# Altium project ethercat32.PrjPcb (part 1 of 3)
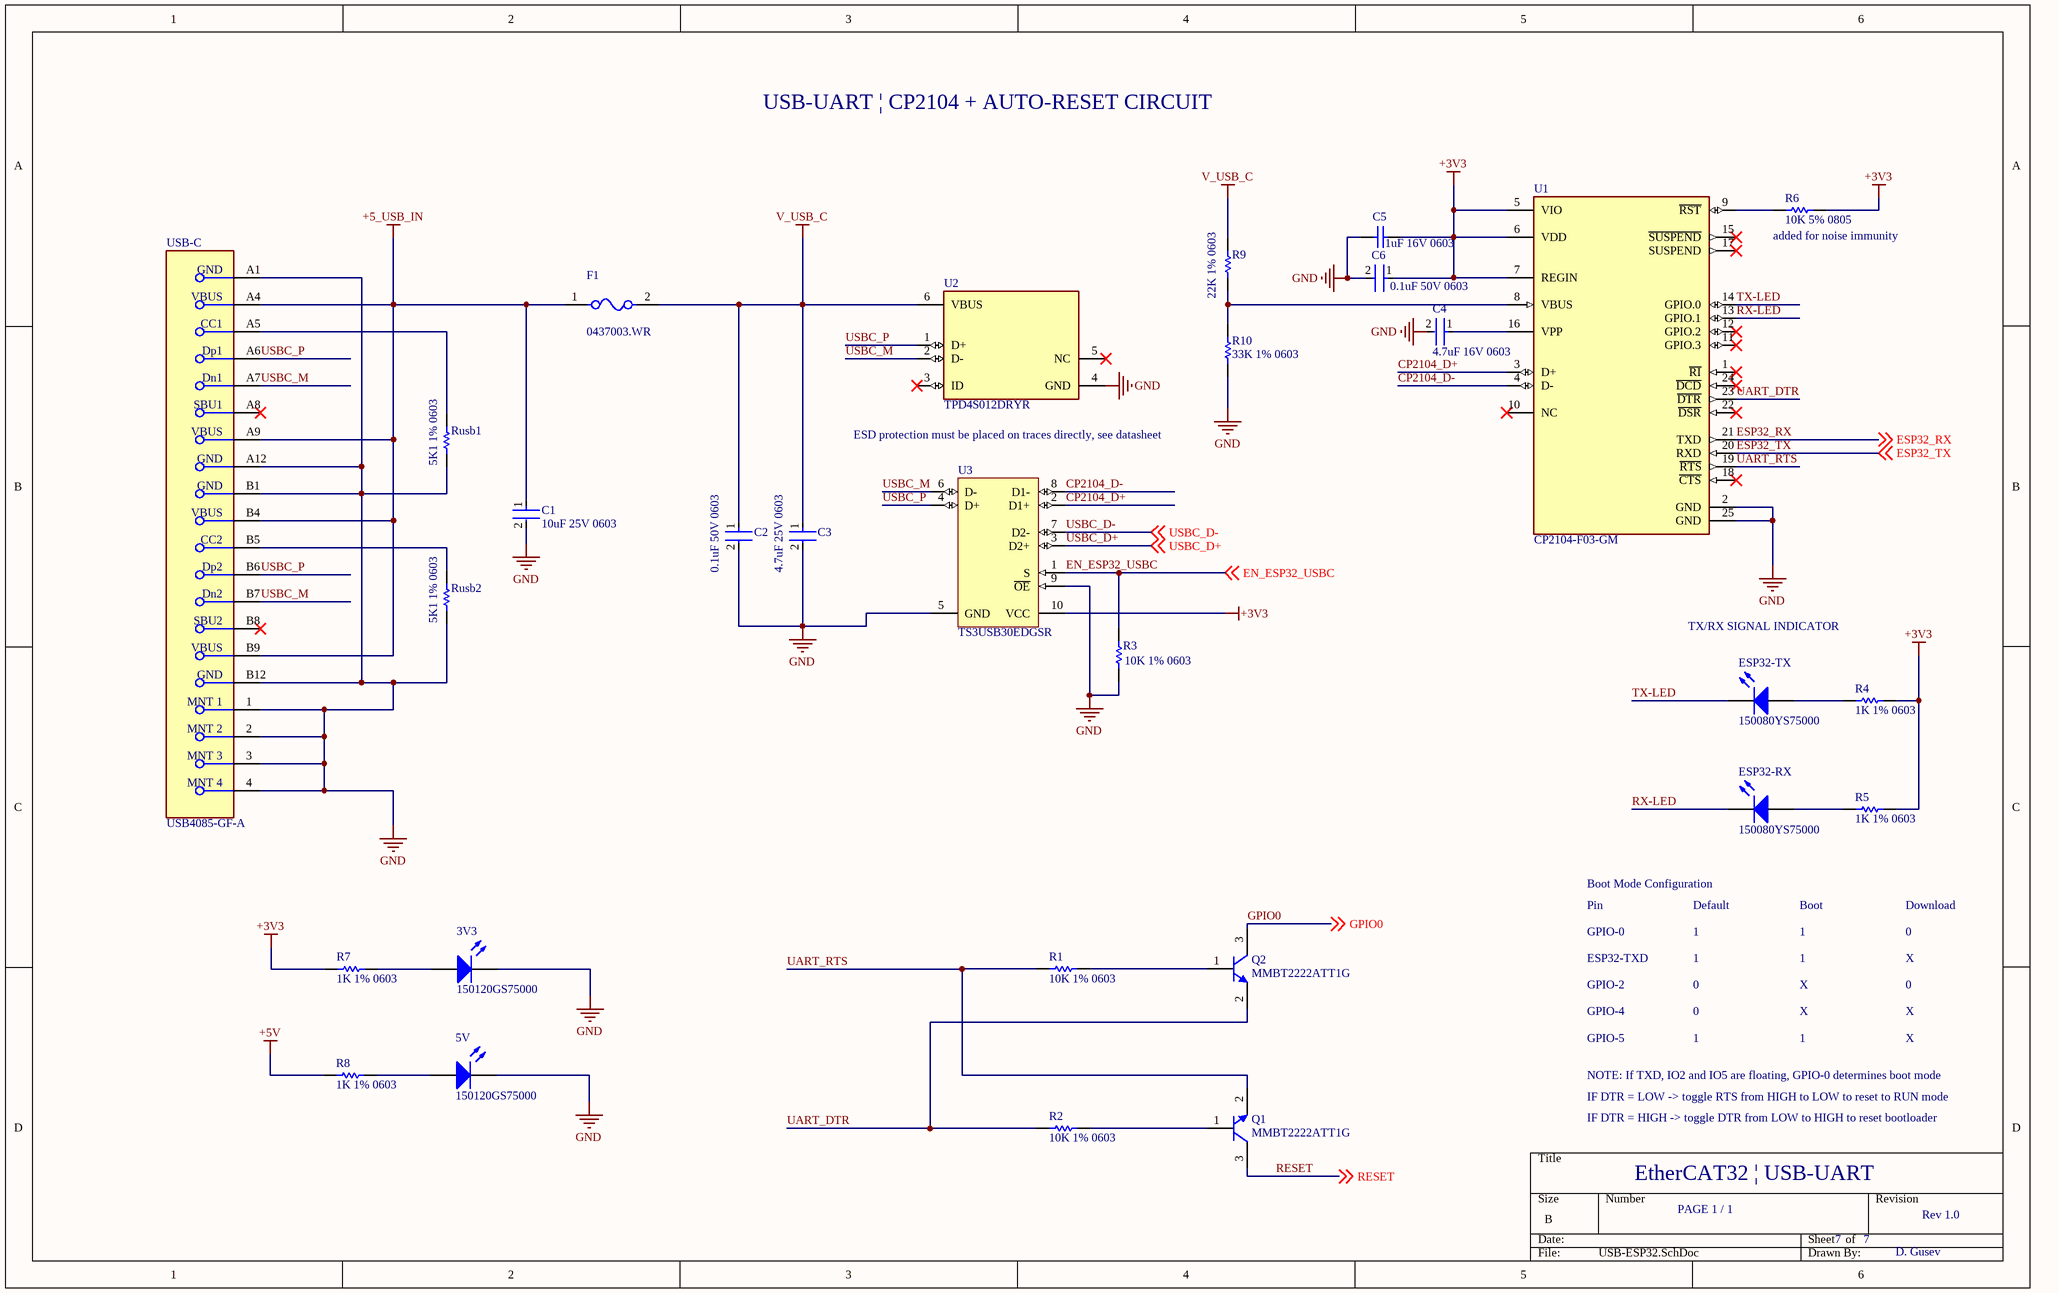
[diagram p0: USB-ESP32.SchDoc]
10 sheets, 301 parts. Net scope: flat (ports and power ports of the same name join across sheets).
Sheets:
  USB-ESP32.SchDoc
  ESP32.SchDoc
  EtherCAT.SchDoc
  LAN9252-1.SchDoc
  LAN9252-2.SchDoc
  DRV8300_CONTROLS.SchDoc
  DRV8300_GATES.SchDoc
  DRV8300_FEEDBACK.SchDoc
  DRV8300_VOLTAGE_REG.SchDoc
  Power_Regulation.SchDoc

## Sheet USB-ESP32.SchDoc
size B

### Parts
3V3  150120GS75000  [1206_A]
5V  150120GS75000  [1206_A]
C1  10uF 25V 0603  [FP-C1608-080-IPC_A]
C2  0.1uF 50V 0603  [FP-C0603C-CF-MFG]
C3  4.7uF 25V 0603  [FP-C1608X5R1E475M080AC-MFG]
C4  4.7uF 16V 0603  [FP-GRM188-0_15-IPC_B]
C5  1uF 16V 0603  [CAPC1608X90X35LL15T15]
C6  0.1uF 50V 0603  [FP-C0603C-CF-MFG]
ESP32-RX  150080YS75000  [0805_A]
ESP32-TX  150080YS75000  [0805_A]
F1  0437003.WR  [FP-437-MFG]
Q1  MMBT2222ATT1G  [ONSC-SC-75-3-463-01_V]
Q2  MMBT2222ATT1G  [ONSC-SC-75-3-463-01_V]
R1  10K 1% 0603  [RESC2013X70X40ML20T20]
R2  10K 1% 0603  [RESC2013X70X40ML20T20]
R3  10K 1% 0603  [RESC2013X70X40ML20T20]
R4  1K 1% 0603  [RESC1608X55X25ML10T15]
R5  1K 1% 0603  [RESC1608X55X25ML10T15]
R6  10K 5% 0805  [RESC2013X60X40ML20T25]
R7  1K 1% 0603  [RESC1608X55X25ML10T15]
R8  1K 1% 0603  [RESC1608X55X25ML10T15]
R9  22K 1% 0603  [RESC1608X55X30NL15T15]
R10  33K 1% 0603  [RESC1608X55X25LL10T15]
Rusb1  5K1 1% 0603  [RESC1608X55X25ML10T15]
Rusb2  5K1 1% 0603  [RESC1608X55X25ML10T15]
U1  CP2104-F03-GM  [FP-CP2104-F03-GM-MFG]
U2  TPD4S012DRYR  [FP-DRY0006A-MFG]
U3  TS3USB30EDGSR  [DGS0010A_N]
USB-C  USB4085-GF-A  [FP-USB4085-GF-A-MFG]

### Nets
+3V3: C5.2 C6.1 R4.2 R5.2 R6.1 R7.1 U1.5(VIO) U1.6(VDD) U1.7(REGIN) U3.10(VCC)
+5_USB_IN: C1.1 F1.1 USB-C.A4(VBUS) USB-C.A9(VBUS) USB-C.B4(VBUS) USB-C.B9(VBUS)
+5V: R8.1
GND: 3V3.1(K) 5V.1(K) C1.2 C2.2 C3.2 C4.2 C5.1 C6.2 R3.1 R10.1 Rusb1.1 Rusb2.1 U1.2(GND) U1.25(GND) U2.4(GND) U3.5(GND) U3.9(~{OE}) USB-C.1(MNT_1) USB-C.2(MNT_2) USB-C.3(MNT_3) USB-C.4(MNT_4) USB-C.A1(GND) USB-C.A12(GND) USB-C.B1(GND) USB-C.B12(GND)
V_USB_C: C2.1 C3.1 F1.2 R9.2 U2.6(VBUS)
CP2104_D+: U1.3(D+) U3.2(D1+)
CP2104_D-: U1.4(D-) U3.8(D1-)
EN_ESP32_USBC: R3.2 U3.1(S) ; off-sheet EN_ESP32_USBC
ESP32_RX: U1.21(TXD) ; off-sheet ESP32_RX
ESP32_TX: U1.20(RXD) ; off-sheet ESP32_TX
GPIO0: Q2.3(C) ; off-sheet GPIO0
RESET: Q1.3(C) ; off-sheet RESET
RX-LED: ESP32-RX.1(K) U1.13(GPIO.1)
TX-LED: ESP32-TX.1(K) U1.14(GPIO.0)
UART_DTR: Q2.2(E) R2.2 U1.23(~{DTR})
UART_RTS: Q1.2(E) R1.2 U1.19(~{RTS})
USBC_D+: U3.3(D2+) ; off-sheet USBC_D+
USBC_D-: U3.7(D2-) ; off-sheet USBC_D-
USBC_M: U2.2(D-) U3.6(D-) USB-C.A7(Dn1) USB-C.B7(Dn2)
USBC_P: U2.1(D+) U3.4(D+) USB-C.A6(Dp1) USB-C.B6(Dp2)
Net3V3_2: 3V3.2(A) R7.2
Net5V_2: 5V.2(A) R8.2
NetC4_1: C4.1 U1.16(VPP)
NetESP32-RX_2: ESP32-RX.2(A) R5.1
NetESP32-TX_2: ESP32-TX.2(A) R4.1
NetQ1_1: Q1.1(B) R2.1
NetQ2_1: Q2.1(B) R1.1
NetR6_2: R6.2 U1.9(~{RST})
NetR9_1: R9.1 R10.2 U1.8(VBUS)
NetRusb1_2: Rusb1.2 USB-C.A5(CC1)
NetRusb2_2: Rusb2.2 USB-C.B5(CC2)

Not connected (* = marked no-connect by the designer): U1 1(~{RI})* 10(NC)* 11(GPIO.3)* 12(GPIO.2)* 15(~{SUSPEND})* 17(SUSPEND)* 18(~{CTS})* 22(~{DSR})* 24(~{DCD})*; U2 3(ID)* 5(NC)*; USB-C A8(SBU1)* B8(SBU2)*

### Notes on the sheet
- USB-UART | CP2104 + AUTO-RESET CIRCUIT
- (near R6) added for noise immunity
- ESD protection must be placed on traces directly, see datasheet
- TX/RX SIGNAL INDICATOR
- Boot Mode Configuration
- Pin
- Default
- Boot
- Download
- GPIO-0
- ESP32-TXD
- 1
- 0
- X
- GPIO-2
- GPIO-4
- GPIO-5
- NOTE: If TXD, IO2 and IO5 are floating, GPIO-0 determines boot mode
- IF DTR = LOW -> toggle RTS from HIGH to LOW to reset to RUN mode
- IF DTR = HIGH -> toggle DTR from LOW to HIGH to reset bootloader
- EtherCAT32 | USB-UART
- PAGE 1 / 1
- 7
- Rev 1.0
- D. Gusev

### Library data of the parts
3V3 5V = CMP-1426-00014-1: SMD mono-color Chip LED, WL-SMCW, Green; Manufacturer: Wuerth Elektronik; PackageReference: 1206_A; PartNumber: 150120GS75000; ComponentLink1Description: Manufacturer URL; ComponentLink2URL: http://katalog.we-online.com/led/datasheet/150120GS75000.pdf; ComponentLink2Description: Datasheet; Color: Green; ComponentLink1URL: http://www.we-online.com
C1 = CMP-2000-05442-2: CAP CER 10UF 25V X5R 0603; Dielectric Material: Ceramic; Tolerance: 20%; Dielectric: X5R; Length: 1.6mm; Termination: SMD/SMT; Depth: 0.8mm; RoHS Compliant: Yes; Construction: Flat; Weight: 7.1E-05oz; Thickness: 0.039inch; Packaging: Tape and Reel; Min Operating Temperature: -55°C; Case Code (Imperial): 0603; Case/Package: 0603; Height: 0.8mm; Case Code (Metric): 1608; Voltage Rating: 25V; Resistor Type: Ceramic; Voltage Rating (DC): 25V; Max Operating Temperature: 85°C; REACH SVHC: No SVHC; Lead Free: Lead Free; Series: C; Width: 0.8mm; Mount: Surface Mount; Package Quantity: 1; Capacitance: 10uF
C2 C6 = CMP-2006-03061-2: CAP CER 0.1UF 50V X7R 0603; Manufacturer: KEMET; Manufacturer Part Number: C0603C104K5RACTU; Tolerance: 0.1; Description: C0603 0.10 μF X7R 30ppm/°C 10.00% 50 V; Temperature Coefficient: 30ppm/°C; Material: Ceramic; Automotive Grade: Grade 1; Value: 0.10 μF; Temperature: -55°C to +125°C; RoHS: TRUE; Temperature Range High: +125°C; Lead Free: Yes; Octopart: https://octopart.com/c0603c104k5ractu-kemet-139244; Digikey Description: CAP CER 0.1UF 50V X7R 0603; Category: Cap; Package: C0603C-CF; ComponentLink2Description: Datasheet; Temperature Range Low: -55°C; Device Class L1: Passive Components; Voltage Rating: 50 V; Automotive: Yes; Device Class L3: Ceramic Capacitors; ComponentLink2URL: https://api.kemet.com/component-edge/download/datasheet/C0603C100J5GACAUTO.pdf; Capacitance: 0.10 μF; Device Class L2: Capacitors; Temperature Characteristic: X7R; Height: 0.87mm
C3 = CMP-08246-004335-1: Multilayer Ceramic Capacitors 4.7μF ±20% 25V X5R SMD 0603; Capacitance: 4.7uF; Voltage Rating (DC): 25V; Width: 0.031inch; Resistor Type: Ceramic; Radiation Hardening: No; Lead Free: Lead Free; Min Operating Temperature: -55°C; Case Code (Metric): 1608; Case/Package: 0603; Case Code (Imperial): 0603; Dielectric Material: Ceramic; Series: C; Thickness: 0.039inch; Tolerance: 20%; Termination: SMD/SMT; Length: 1.6mm; Depth: 0.8mm; Mount: Surface Mount; Voltage Rating: 25V; Weight: 7.1E-05oz; RoHS Compliant: Yes; Height: 0.8mm; Dielectric: X5R; REACH SVHC: No SVHC; Packaging: Tape and Reel; Max Operating Temperature: 85°C; Package Quantity: 1
C4 = CMP-06035-062935-1: CAP CER 4.7UF 16V X5R 0603; Tolerance: 10%; Material: Ceramic; Thickness: 0.037inch; RoHS Compliant: Yes; REACH SVHC: No SVHC; Case Code (Metric): 1608; Width: 0.8mm; Lead Free: Lead Free; Packaging: Tape and Reel; Capacitance: 4.7uF; Depth: 0.8mm; Package Quantity: 4000; Mount: Surface Mount; Voltage Rating: 16V; Termination: SMD/SMT; Height: 0.8mm; Voltage Rating (DC): 16V; Weight: 0.000222oz; Dielectric: X5R; Case Code (Imperial): 0603; Series: GRM; Min Operating Temperature: -55°C; Max Operating Temperature: 85°C; Case/Package: 0603; Length: 1.6mm
C5 = CMP-2006-02298-2: Manufacturer: Kemet; Part Number: C0603C105K4RACTU
ESP32-RX ESP32-TX = CMP-1426-00012-1: SMD mono-color Chip LED, WL-SMCW, Yellow; Manufacturer: Wuerth Elektronik; Color: Yellow; ComponentLink1URL: http://www.we-online.com; PackageReference: 0805_A; ComponentLink2URL: http://katalog.we-online.com/led/datasheet/150080YS75000.pdf; ComponentLink1Description: Manufacturer URL; ComponentLink2Description: Datasheet; PartNumber: 150080YS75000
F1 = CMP-08605-000049-1: FUSE BRD MNT 3A 32VAC 35VDC 1206; Manufacturer: Littelfuse Inc; Fuse Interrupt Ac Current: 50A; Value: 0.033Ω; Fuse Blow Speed: Fast; Voltage Rating: 32V; Max Fuse Dc Voltage: 35V; Fuse I2T: 0.506A2Sec; Fuse Voltage Drop: 0.14V; Octopart: https://octopart.com/0437003.wr-littelfuse-8600121; Category: Fuse; Fuse Interrupt Dc Current: 50A; Temperature: -55°C to +150°C; Device Class L1: Circuit Protection; Fuse Current: 3A; Temperature Range High: +150°C; Temperature Range Low: -55°C; Resistance: 0.033Ω; Automotive: No; ComponentLink2URL: https://www.littelfuse.com/~/media/electronics/datasheets/fuses/littelfuse_fuse_437_datasheet.pdf.pdf; Manufacturer Part Number: 0437003.WR; Ipc Land Pattern Name: CAPC320163X82; Mouser Description: Surface Mount Fuses 32V FA 1206 3A; Device Class L2: Fuses; Device Class L3: unset; Package: 437; RoHS: TRUE; Height: 0.8639mm; Digikey Description: FUSE BRD MNT 3A 32VAC 35VDC 1206; ComponentLink2Description: Datasheet; Lead Free: Yes; Max Fuse Ac Voltage: 32V
Q1 Q2 = CMP-1048-00417-1: General Purpose Transistor, NPN Silicon, 3-Pin SC-75, Pb-Free, Tape and Reel; Manufacturer: On Semiconductor; IC Continuous (A): 0.6; fT Min (MHz): 300; DatasheetVersion: Rev. 5; PackageVersion: Rev. F, 07/2005; ComponentLink1Description: Manufacturer URL; RoHS: TRUE; Packing: Tape and Reel; ComponentLink3URL: http://www.onsemi.com/pub_link/Collateral/463-01.PDF; ComponentLink1URL: http://www.onsemi.com/; ComponentLink3Description: Package Specification; ComponentLink2URL: http://www.onsemi.cn/pub_link/Collateral/MMBT2222ATT1-D.PDF; Mounting Technology: Surface Mount; PartNumber: MMBT2222ATT1G; ComponentLink2Description: Datasheet; Polarity: NPN; PackageReference: SC-75-3-463-01; PackageDescription: 3-Pin Small Outline Transistor, Body 1.6 x 0.8 mm, Pitch 0.5 mm
R1-R3 = CMP-2001-04376-1: Manufacturer: Panasonic; Part Number: ERJ-6ENF1002V
R4 R5 R7 R8 = CMP-2000-05023-1: Chip Resistor, 1 KOhm, +/- 5%, 0.063 W, -55 to 155 degC, 0603 (1608 Metric), RoHS, Tape and Reel; Manufacturer: Yageo; Resistor Case Style: 0603[1608Metric]; Resistor Element Type: ThickFilm; Product Range: RCSeries; Resistance: 1kohm; SVHC: ToBeAdvised; Voltage Rating: 50V; Temperature Coefficient: ±100ppm/degC; Power Rating: 100mW; Packaging: CutTape; Manufacturer URL: http://www.yageo.com/; Resistance Tolerance: ±5%; Datasheet Version: Rev. 4, 04/2009; MSL: MSL1-Unlimited; Package Description: 2-Pin Surface Mount Device, Body 1.6 x 0.8 mm; Automotive Qualification Standard: -; Package Reference: 603; Datasheet URL: https://datasheet.ciiva.com/2452/pyu-rc0603-51-rohs-l-4-2452848.pdf
R6 = CMP-2001-00590-1: Part Number: ERA6AEB123V; Manufacturer: Panasonic
R9 = CMP-2000-00337-2: Chip Resistor, 22 KOhm, +/- 1%, 0.1 W, -55 to 155 degC, 0603 (1608 Metric), RoHS, Tape and Reel; Resistance: 33.2 kohm; Case\Package: 0603; Power Rating: 100 mW; Voltage Rating: 50 V; ComponentLink2Description: Datasheet; PackageDescription: 2-Pin Surface Mount Device, Body 1.6 x 0.85 mm; Length: 1.6 mm; Package Quantity: 200; ComponentLink1Description: Manufacturer URL; Width: 0.8 mm; Tolerance: 1%; ComponentLink2URL: http://industrial.panasonic.com/cdbs/www-data/pdf/RDA0000/AOA0000C86.pdf; Case Code (Metric): 1608; Case Code (Imperial): 0603; PackageReference: 0603; DatasheetVersion: Apr-15; Packaging: Tape and Reel; Max Operating Temperature: 155 degC; Height: 0.45 mm; ComponentLink1URL: http://www.panasonic.com/; Min Operating Temperature: -55 degC; RoHSCompliant: true
R10 = CMP-2000-06938-1: Chip Resistor, 33 KOhm, +/- 1%, 0.1 W, -55 to 155 degC, 0603 (1608 Metric), RoHS, Tape and Reel; Manufacturer: Yageo; Voltage Rating: 50V; Power Rating: 100mW; Resistance: 33kOhms; Temperature Coefficient: 100PPM/C; Datasheet Version: Rev. 7, 05/2017; Case Code - in: 0603; Product: ThickFilmResistorsGeneralPurpose; Tolerance: 1%; Case Code - mm: 1608; Manufacturer URL: http://www.yageo.com/; Datasheet URL: http://www.yageo.com/documents/recent/PYu-RC_Group_51_RoHS_L_7.pdf; Termination Style: SMD/SMT; Package Description: 2-Pin Surface Mount Device, Body 1.6 x 0.8 mm; Series: RC; Packaging: Reel; Mounting Technology: SurfaceMount; Operating Temperature Range: -55Cto+155C; Package Reference: 0603
Rusb1 Rusb2 = CMP-2000-04091-1: Manufacturer: Yageo; Part Number: RC0603FR-075K1L
U1 = CMP-0511-00004-2: IC SGL USB-TO-UART BRIDGE 24QFN; Number of Transceivers: 1; Max Supply Voltage: 3.6V; Operating Supply Current: 17mA; Operating Supply Voltage: 3.3V; Data Rate: 2Mbps; Min Supply Voltage: 3V; Number of Channels: 1; Max Operating Temperature: 85°C; Contact Plating: Tin; Min Operating Temperature: -40°C; Number of Pins: 24; Case/Package: QFN; Packaging: Rail/Tube; Radiation Hardening: No; Weight: 0.001764oz
U2 = CMP-0326-00038-4: TVS DIODE 5.5V 6SON; Breakdown Voltage: 24V; Interface: USB; ESD Protection: Yes; Peak Pulse Power: 60W; Number of Circuits: 4; Polarity: Unidirectional; Capacitance: 15pF; Test Current: 1mA; Working Voltage: 19V; Min Breakdown Voltage: 6V; Peak Pulse Current: 3A; Operating Supply Voltage: 950mV; Max Operating Temperature: 85°C; Packaging: Tape and Reel; Termination: SMD/SMT; Number of Pins: 6; Radiation Hardening: No; Width: 1.05mm; REACH SVHC: No SVHC; Lead Free: Lead Free; Depth: 1mm; Package Quantity: 5000; Length: 1.45mm; Direction: Unidirectional; Min Operating Temperature: -40°C; Number of Channels: 4; Max Power Dissipation: 60W; Height: 0.55mm
U3 = CMP-0309-00091-2: High-Speed USB 2.0 (480-Mbps) 1:2 Multiplexer / Demultiplexer Switch with Single, 10 ohm RON, 3.0 to 4.3V, -40 to 85 degC, 10-Pin MSOP (DGS), Green (RoHS & no Sb/Br); Manufacturer: Texas Instruments; Architecture: "1","2 mux/demux"; tpd max(ns): 0.25; ICC(uA): 1; IL OFF(Max)(nA): 2; OFF Time(Max)(ns): 30; SubFamily: USB Switch; ESD HBM(kV): +/-8; Bandwidth(MHz): 900; RON Mis-match(Max)(Ohms): 0.35; ON Time(Max)(ns): 25; ron(max)(ohms): 10; PartNumber: TS3USB30EDGSR; ComponentLink1URL: http://www.ti.com/general/docs/lit/getliterature.tsp?genericPartNumber=TS3USB30E&fileType=pdf; Vcc range(V): 3.0 to 4.3; PackageReference: DGS0010A; Code_JEDEC: MO-187-BA; PackageDescription: 10-Pin Thin Shrink Small Outline Package 0.5 mm Pitch; Eco-Plan: Green (RoHS & no Sb/Br); ComponentLink2URL: http://www.ti.com/litv/pdf/mpds035b; Number of Channels: 2; Mounting Technology: Surface Mount; PackageVersion: revC, Feb-2004; DatasheetVersion: SCDS255D; ComponentLink1Description: Datasheet; ComponentLink2Description: Package Specification; RON Flatness(Max)(Ohms): 2
USB-C = CMP-196119-000001-1: CONN RCPT USB2.0 TYPEC 16POS; Manufacturer: Global Connector Technology; Voltage Rating: 20V; Conn Orientation: Right Angle; Shielding: true; Current Rating: 4.25A; Number Of Contacts: 16; Pitch: 0.85mm; Is Female: yes; ComponentLink2URL: https://gct.co/files/drawings/usb4085.pdf; Category: Conn; Automotive: No; ComponentLink2Description: Datasheet; Height: 3.66mm; Manufacturer Part Number: USB4085-GF-A; Package: 0; Usb Standard: USB 2.0; Octopart: https://octopart.com/usb4085-gf-a-global+connector+technology-94773699; Device Class L3: unset; Digikey Description: CONN RCPT USB2.0 TYPEC 16POS; Temperature Range Low: -40°C; Temperature: -40°C to +85°C; Lead Free: Yes; Contact Material: Gold,Nickel; Device Class L1: Connectors; Temperature Range High: +85°C; Device Class L2: USB Connectors; RoHS: TRUE

## Sheet ESP32.SchDoc
size B
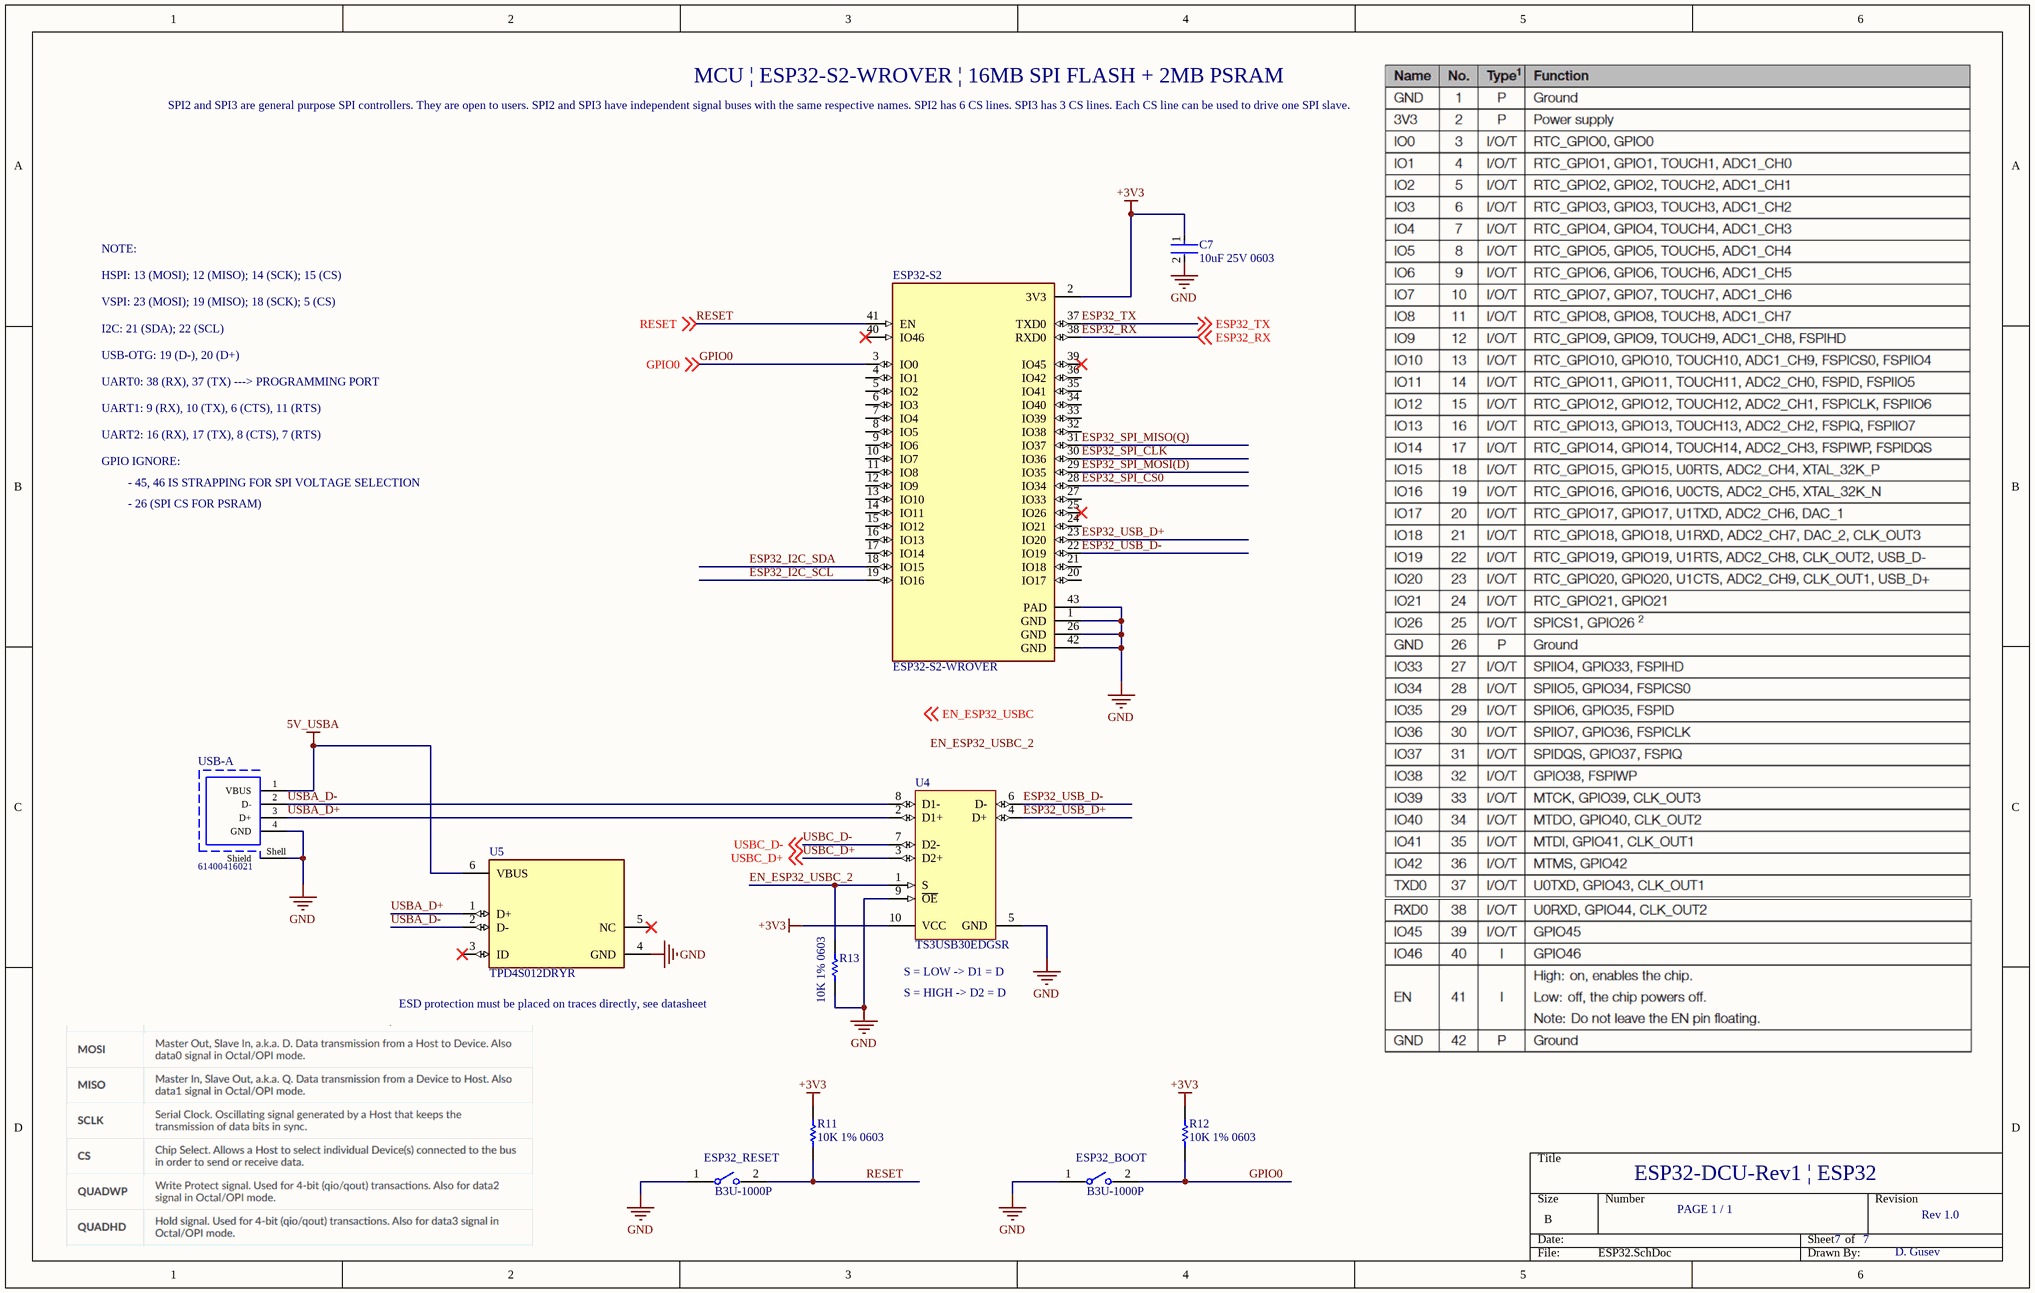
[diagram p1: ESP32.SchDoc]

### Parts
C7  10uF 25V 0603  [FP-C1608-080-IPC_A]
ESP32-S2  ESP32-S2-WROVER  [MODULE_ESP32-S2-WROVER]
ESP32_BOOT  B3U-1000P  [FP-B3U-1000P-MFG]
ESP32_RESET  B3U-1000P  [FP-B3U-1000P-MFG]
R11  10K 1% 0603  [RESC2013X70X40ML20T20]
R12  10K 1% 0603  [RESC2013X70X40ML20T20]
R13  10K 1% 0603  [RESC2013X70X40ML20T20]
U4  TS3USB30EDGSR  [DGS0010A_N]
U5  TPD4S012DRYR  [FP-DRY0006A-MFG]
USB-A  61400416021  [61400416021]

### Nets
5V_USBA: U5.6(VBUS) USB-A.1(VBUS)
+3V3: C7.1 ESP32-S2.2(3V3) R11.1 R12.1 U4.10(VCC)
GND: C7.2 ESP32-S2.1(GND) ESP32-S2.26(GND) ESP32-S2.42(GND) ESP32-S2.43(PAD) ESP32_BOOT.1 ESP32_RESET.1 R13.2 U4.5(GND) U4.9(~{OE}) U5.4(GND) USB-A.4(GND) USB-A.Shell(Shield)
EN_ESP32_USBC_2: R13.1 U4.1(S)
ESP32_I2C_SCL: ESP32-S2.19(IO16)
ESP32_I2C_SDA: ESP32-S2.18(IO15)
ESP32_RX: ESP32-S2.38(RXD0) ; off-sheet ESP32_RX
ESP32_SPI_CLK: ESP32-S2.30(IO36)
ESP32_SPI_CS0: ESP32-S2.28(IO34)
ESP32_SPI_MISO(Q): ESP32-S2.31(IO37)
ESP32_SPI_MOSI(D): ESP32-S2.29(IO35)
ESP32_TX: ESP32-S2.37(TXD0) ; off-sheet ESP32_TX
ESP32_USB_D+: ESP32-S2.23(IO20) U4.4(D+)
ESP32_USB_D-: ESP32-S2.22(IO19) U4.6(D-)
GPIO0: ESP32-S2.3(IO0) ESP32_BOOT.2 R12.2 ; off-sheet GPIO0
RESET: ESP32-S2.41(EN) ESP32_RESET.2 R11.2 ; off-sheet RESET
USBA_D+: U4.2(D1+) U5.1(D+) USB-A.3(D+)
USBA_D-: U4.8(D1-) U5.2(D-) USB-A.2(D-)
USBC_D+: U4.3(D2+) ; off-sheet USBC_D+
USBC_D-: U4.7(D2-) ; off-sheet USBC_D-

Not connected (* = marked no-connect by the designer): ESP32-S2 4(IO1) 5(IO2) 6(IO3) 7(IO4) 8(IO5) 9(IO6) 10(IO7) 11(IO8) 12(IO9) 13(IO10) 14(IO11) 15(IO12) 16(IO13) 17(IO14) 20(IO17) 21(IO18) 24(IO21) 25(IO26)* 27(IO33) 32(IO38) 33(IO39) 34(IO40) 35(IO41) 36(IO42) 39(IO45)* 40(IO46)*; U5 3(ID)* 5(NC)*

### Notes on the sheet
- MCU | ESP32-S2-WROVER | 16MB SPI FLASH + 2MB PSRAM
- SPI2 and SPI3 are general purpose SPI controllers. They are open to users. SPI2 and SPI3 have independent signal buses with the same respective names. SPI2 has 6 CS lines. SPI3 has 3 CS lines. Each CS line can be used to drive one SPI slave.
- NOTE:
- HSPI: 13 (MOSI); 12 (MISO); 14 (SCK); 15 (CS)
- VSPI: 23 (MOSI); 19 (MISO); 18 (SCK); 5 (CS)
- I2C: 21 (SDA); 22 (SCL)
- USB-OTG: 19 (D-), 20 (D+)
- UART0: 38 (RX), 37 (TX) ---> PROGRAMMING PORT
- UART1: 9 (RX), 10 (TX), 6 (CTS), 11 (RTS)
- UART2: 16 (RX), 17 (TX), 8 (CTS), 7 (RTS)
- GPIO IGNORE:
- - 45, 46 IS STRAPPING FOR SPI VOLTAGE SELECTION
- - 26 (SPI CS FOR PSRAM)
- (near U4) S = LOW -> D1 = D
- ESD protection must be placed on traces directly, see datasheet
- S = HIGH -> D2 = D
- ESP32-DCU-Rev1 | ESP32
- PAGE 1 / 1
- 7
- Rev 1.0
- D. Gusev
- Labels drawn without touching a wire or pin: EN_ESP32_USBC, EN_ESP32_USBC_2

### Library data of the parts
C7 = CMP-2000-05442-2: as C1 on sheet USB-ESP32; Dielectric: X5R; Length: 1.6mm; Termination: SMD/SMT; Depth: 0.8mm; RoHS Compliant: Yes; Construction: Flat; Weight: 7.1E-05oz; Thickness: 0.039inch; Packaging: Tape and Reel; Min Operating Temperature: -55°C; Case Code (Imperial): 0603; Case/Package: 0603; Height: 0.8mm; Case Code (Metric): 1608; Voltage Rating: 25V; Resistor Type: Ceramic; Voltage Rating (DC): 25V; Max Operating Temperature: 85°C; REACH SVHC: No SVHC; Lead Free: Lead Free; Series: C; Width: 0.8mm; Mount: Surface Mount; Package Quantity: 1; Capacitance: 10uF
ESP32-S2 = ESP32-S2-WROVER: WiFi 802.11b/g/n Transceiver Module 2.4GHz PCB Trace Surface Mount; MF: Espressif Systems; Check_prices: https://www.snapeda.com/parts/ESP32-S2-WROVER/Espressif%20Systems/view-part/4614060/?ref=eda; SnapEDA_Link: https://www.snapeda.com/parts/ESP32-S2-WROVER/Espressif%20Systems/view-part/4614060/?ref=snap; Value: *; MP: ESP32-S2-WROVER; Package: None; Price: None; Availability: In Stock
ESP32_BOOT ESP32_RESET = CMP-2100-03586-2: SWITCH TACTILE SPST-NO 0.05A 12V; Contact Resistance: 100mR; Operating Force: 1.5N; Max Current Rating: 50mA; Switch Travel: 0.15mm; Actuator Type: Standard; Mechanical Life: 200000Cycles; Ratings: Dust Proof; Illumination Type: Non-Illuminated; Throw Configuration: SPST; Actuator Length: 0.4mm; Switch Function: Off-Mom; Height: 1.2mm; Width: 3mm; Weight: 0.000776oz; Contact Material: Silver; Max Voltage Rating (DC): 12V; Insulation Resistance: 100MR; Lead Free: Lead Free; Current Rating: 50mA; Termination: SMD/SMT; Length: 4mm; Voltage Rating (DC): 12V; Contact Current Rating: 50mA; Orientation: Straight; Depth: 2.5mm; Max Operating Temperature: 70°C; Packaging: Tape and Reel; Min Operating Temperature: -25°C; Package Quantity: 1; Mount: Surface Mount; Electrical Life: 200000Cycles
R11-R13 = CMP-2001-04376-1: as R1 on sheet USB-ESP32
U4 = CMP-0309-00091-2: as U3 on sheet USB-ESP32; PartNumber: TS3USB30EDGSR; ComponentLink1URL: http://www.ti.com/general/docs/lit/getliterature.tsp?genericPartNumber=TS3USB30E&fileType=pdf; Vcc range(V): 3.0 to 4.3; PackageReference: DGS0010A; Code_JEDEC: MO-187-BA; PackageDescription: 10-Pin Thin Shrink Small Outline Package 0.5 mm Pitch; Eco-Plan: Green (RoHS & no Sb/Br); ComponentLink2URL: http://www.ti.com/litv/pdf/mpds035b; Number of Channels: 2; Mounting Technology: Surface Mount; PackageVersion: revC, Feb-2004; DatasheetVersion: SCDS255D; ComponentLink1Description: Datasheet; ComponentLink2Description: Package Specification; RON Flatness(Max)(Ohms): 2
U5 = CMP-0326-00038-4: as U2 on sheet USB-ESP32; Max Operating Temperature: 85°C; Packaging: Tape and Reel; Termination: SMD/SMT; Number of Pins: 6; Radiation Hardening: No; Width: 1.05mm; REACH SVHC: No SVHC; Lead Free: Lead Free; Depth: 1mm; Package Quantity: 5000; Length: 1.45mm; Direction: Unidirectional; Min Operating Temperature: -40°C; Number of Channels: 4; Max Power Dissipation: 60W; Height: 0.55mm
USB-A = CMP-1502-03227-1: USB 2.0 Type A Receptacle WR-COM, Horizontal, THT; Manufacturer: Wurth Elektronik; Working Voltage: 30VAC; Rated Current: 1.5A; Contact Resistance: 20mOhm; Manufacturer URL: http://www.we-online.de; Publisher: WurthElektronik; Packaging: Tray; Operating Temperature: -40to105degC; Orientation: Horizontal; Mounting Technology: THT; Part Number: 61400416021; Gender: Receptacle; Package Reference: 61400416021; Connector Type: USB2.0TypeA; Datasheet URL: https://katalog.we-online.de/em/datasheet/61400416021.pdf

## Sheet EtherCAT.SchDoc
size B
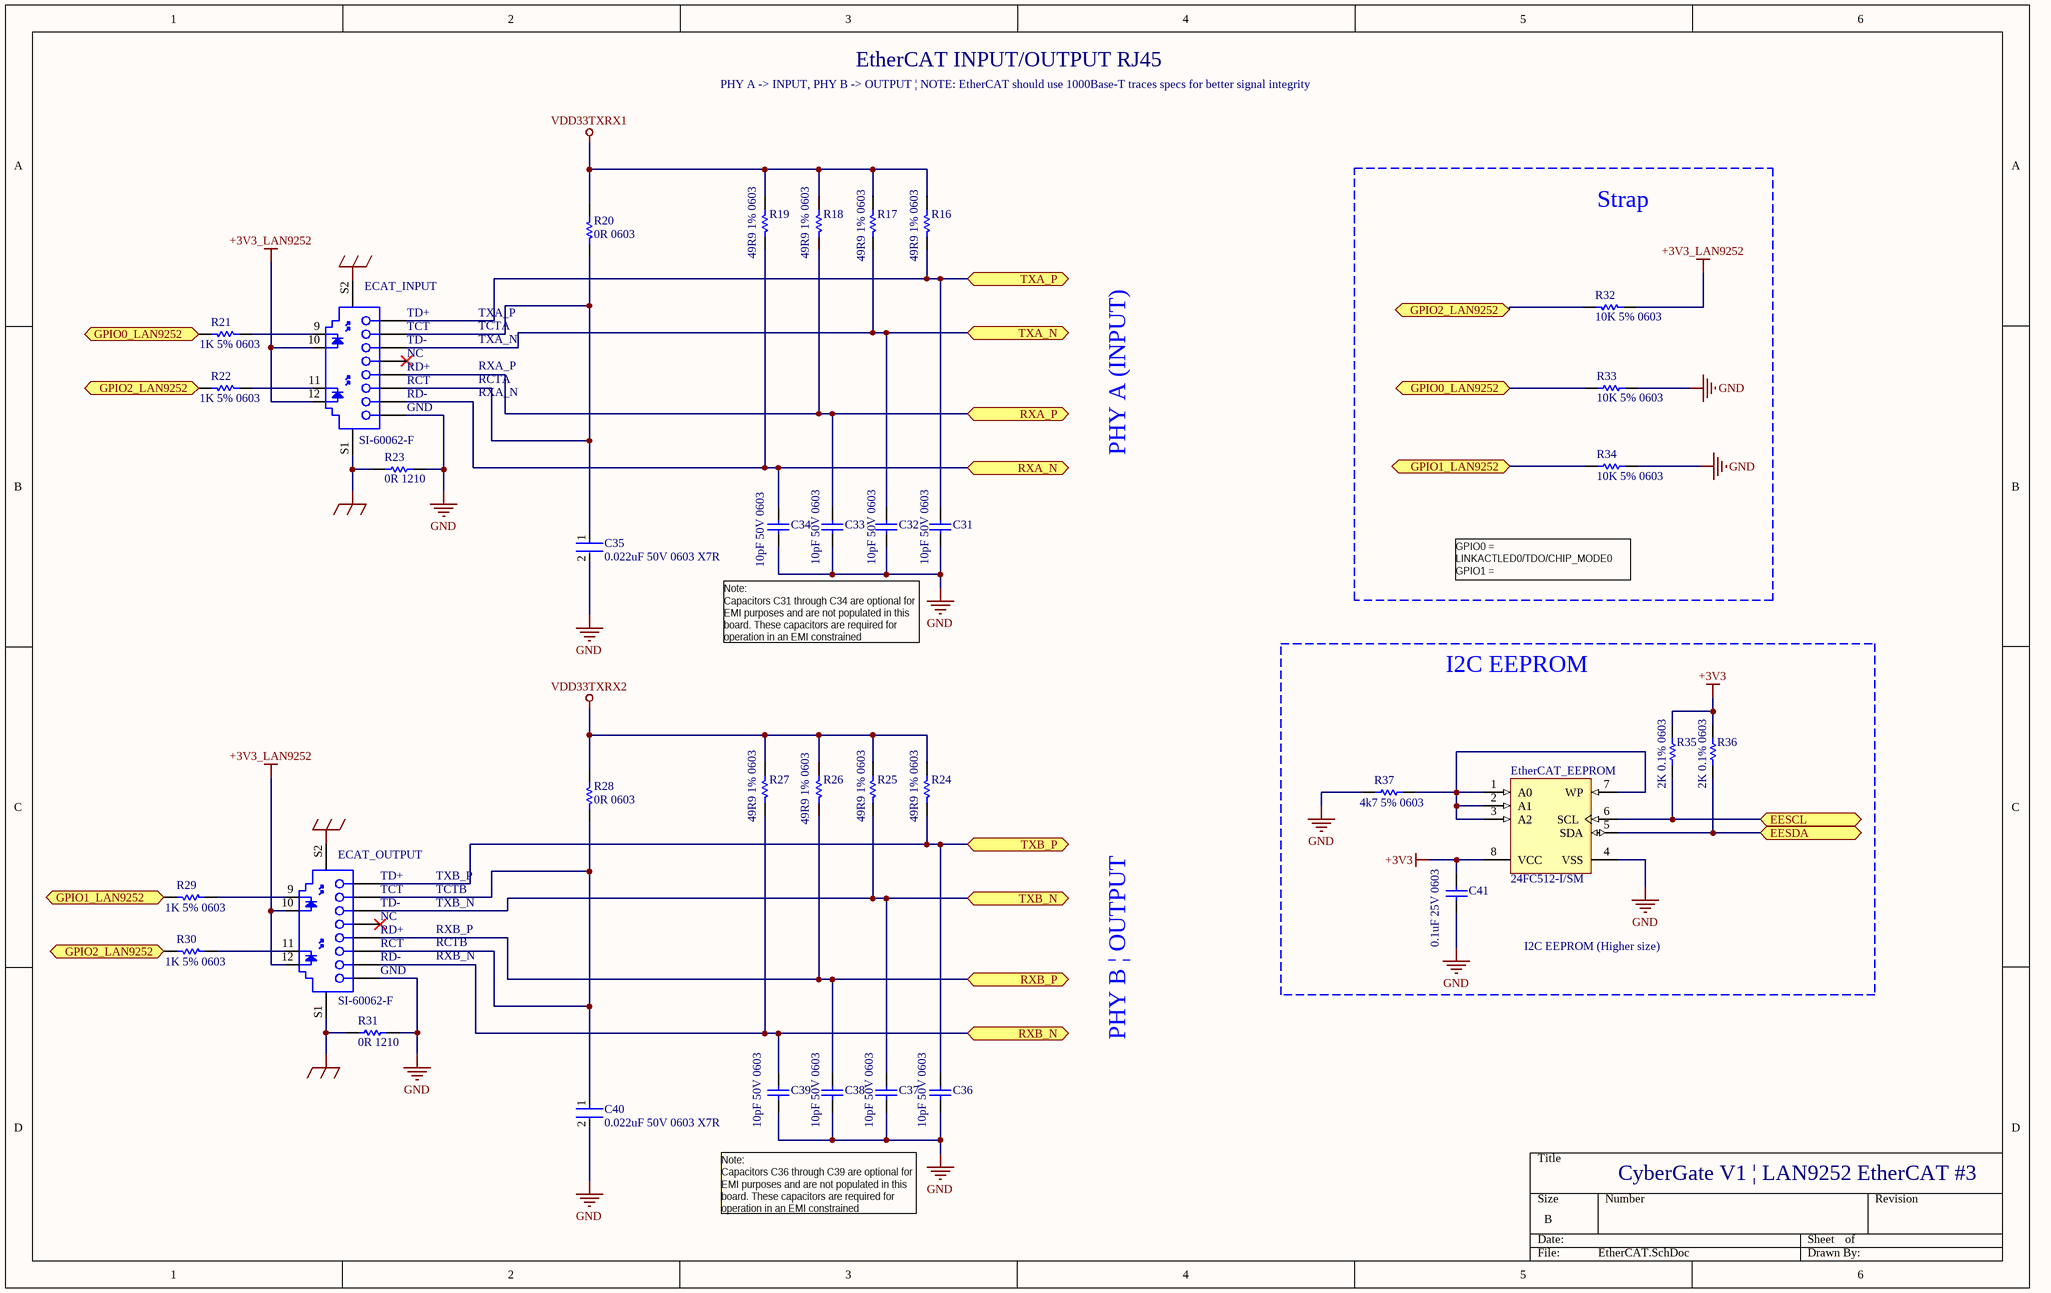
[diagram p2: EtherCAT.SchDoc]

### Parts
C31  10pF 50V 0603  [CAPC1608X90X35LL10T15]
C32  10pF 50V 0603  [CAPC1608X90X35LL10T15]
C33  10pF 50V 0603  [CAPC1608X90X35LL10T15]
C34  10pF 50V 0603  [CAPC1608X90X35LL10T15]
C35  0.022uF 50V 0603 X7R  [FP-C0603C-CF-MFG]
C36  10pF 50V 0603  [CAPC1608X90X35LL10T15]
C37  10pF 50V 0603  [CAPC1608X90X35LL10T15]
C38  10pF 50V 0603  [CAPC1608X90X35LL10T15]
C39  10pF 50V 0603  [CAPC1608X90X35LL10T15]
C40  0.022uF 50V 0603 X7R  [FP-C0603C-CF-MFG]
C41  0.1uF 25V 0603  [CAPC1608X90X35LL10T15]
ECAT_INPUT  SI-60062-F  [BELF-SI-60062-F_V]
ECAT_OUTPUT  SI-60062-F  [BELF-SI-60062-F_V]
EtherCAT_EEPROM  24FC512-I/SM  [SOIJ-SM8_M]
R16  49R9 1% 0603  [RESC1608X55X25NL10T15]
R17  49R9 1% 0603  [RESC1608X55X25NL10T15]
R18  49R9 1% 0603  [RESC1608X55X25NL10T15]
R19  49R9 1% 0603  [RESC1608X55X25NL10T15]
R20  0R 0603  [RESC1608X55X25ML10T15]
R21  1K 5% 0603  [RESC1608X55X25NL10T15]
R22  1K 5% 0603  [RESC1608X55X25NL10T15]
R23  0R 1210  [RESC3225X60X45ML20T20]
R24  49R9 1% 0603  [RESC1608X55X25NL10T15]
R25  49R9 1% 0603  [RESC1608X55X25NL10T15]
R26  49R9 1% 0603  [RESC1608X55X25NL10T15]
R27  49R9 1% 0603  [RESC1608X55X25NL10T15]
R28  0R 0603  [RESC1608X55X25ML10T15]
R29  1K 5% 0603  [RESC1608X55X25NL10T15]
R30  1K 5% 0603  [RESC1608X55X25NL10T15]
R31  0R 1210  [RESC3225X60X45ML20T20]
R32  10K 5% 0603  [RESC1608X55X25ML10T15]
R33  10K 5% 0603  [RESC1608X55X25ML10T15]
R34  10K 5% 0603  [RESC1608X55X25ML10T15]
R35  2K 0.1% 0603  [RESC1608X55X25ML10T15]
R36  2K 0.1% 0603  [RESC1608X55X25ML10T15]
R37  4k7 5% 0603  [RESC1608X55X25ML10T15]

### Blocks framed on the sheet
Strap: R32-R34
I2C EEPROM: C41 EtherCAT_EEPROM R35-R37

### Ports
EESCL (bidir), EESDA (bidir), GPIO0_LAN9252 (bidir), GPIO1_LAN9252 (bidir), GPIO2_LAN9252 (bidir), RXA_N (bidir), RXA_P (bidir), RXB_N (bidir), RXB_P (bidir), TXA_N (bidir), TXA_P (bidir), TXB_N (bidir), TXB_P (bidir)

### Nets
+3V3: C41.2 EtherCAT_EEPROM.8(VCC) R35.2 R36.2
+3V3_LAN9252: ECAT_INPUT.10 ECAT_INPUT.12 ECAT_OUTPUT.10 ECAT_OUTPUT.12 R32.2
Earth2: ECAT_INPUT.S1 ECAT_INPUT.S2 ECAT_OUTPUT.S1 ECAT_OUTPUT.S2 R23.1 R31.1
GND: C31.1 C32.1 C33.1 C34.1 C35.2 C36.1 C37.1 C38.1 C39.1 C40.2 C41.1 ECAT_INPUT.8(GND) ECAT_OUTPUT.8(GND) EtherCAT_EEPROM.4(VSS) R23.2 R31.2 R33.1 R34.1 R37.1
VDD33TXRX1: R16.2 R17.2 R18.2 R19.2 R20.2
VDD33TXRX2: R24.2 R25.2 R26.2 R27.2 R28.2
RXA_N: C34.2 ECAT_INPUT.7(RD-) R19.1 ; port RXA_N
RXA_P: C33.2 ECAT_INPUT.5(RD+) R18.1 ; port RXA_P
RXB_N: C39.2 ECAT_OUTPUT.7(RD-) R27.1 ; port RXB_N
RXB_P: C38.2 ECAT_OUTPUT.5(RD+) R26.1 ; port RXB_P
TXA_N: C32.2 ECAT_INPUT.3(TD-) R17.1 ; port TXA_N
TXA_P: C31.2 ECAT_INPUT.1(TD+) R16.1 ; port TXA_P
TXB_N: C37.2 ECAT_OUTPUT.3(TD-) R25.1 ; port TXB_N
TXB_P: C36.2 ECAT_OUTPUT.1(TD+) R24.1 ; port TXB_P
NetC35_1: C35.1 ECAT_INPUT.2(TCT) ECAT_INPUT.6(RCT) R20.1
NetC40_1: C40.1 ECAT_OUTPUT.2(TCT) ECAT_OUTPUT.6(RCT) R28.1
NetECAT_INPUT_9: ECAT_INPUT.9 R21.1
NetECAT_INPUT_11: ECAT_INPUT.11 R22.1
NetECAT_OUTPUT_9: ECAT_OUTPUT.9 R29.1
NetECAT_OUTPUT_11: ECAT_OUTPUT.11 R30.1
NetEtherCAT_EEPROM_1: EtherCAT_EEPROM.1(A0) EtherCAT_EEPROM.2(A1) EtherCAT_EEPROM.3(A2) EtherCAT_EEPROM.7(WP) R37.2
NetEtherCAT_EEPROM_5: EtherCAT_EEPROM.5(SDA) R36.1 ; port EESDA
NetEtherCAT_EEPROM_6: EtherCAT_EEPROM.6(SCL) R35.1 ; port EESCL
NetLAN9252_45: R22.2 R30.2 R32.1 ; port GPIO2_LAN9252
NetLAN9252_46: R29.2 R34.2 ; port GPIO1_LAN9252
NetLAN9252_48: R21.2 R33.2 ; port GPIO0_LAN9252

Not connected (* = marked no-connect by the designer): ECAT_INPUT 4(NC)*; ECAT_OUTPUT 4(NC)*

### Notes on the sheet
- PHY A -> INPUT, PHY B -> OUTPUT | NOTE: EtherCAT should use 1000Base-T traces specs for better signal integrity
- EtherCAT INPUT/OUTPUT RJ45
- PHY A (INPUT)
- TXA_P
- TCTA
- TXA_N
- RXA_P
- RCTA
- RXA_N
- Note:
  Capacitors C31 through C34 are optional for EMI purposes and are not populated in this  board. These capacitors are required for operation in an EMI constrained environment.
- GPIO0 = LINKACTLED0/TDO/CHIP_MODE0
  GPIO1 = LINKACTLED1/TDI/CHIP_MODE1
  GPIO2 = RUNLED/E2PSIZE
- (near ECAT_OUTPUT) TXB_P
- TCTB
- (near ECAT_OUTPUT) TXB_N
- PHY B | OUTPUT
- (near ECAT_OUTPUT) RXB_P
- RCTB
- RXB_N
- I2C EEPROM (Higher size)
- Note:
  Capacitors C36 through C39 are optional for EMI purposes and are not populated in this  board. These capacitors are required for operation in an EMI constrained environment.
- CyberGate V1 | LAN9252 EtherCAT #3

### Library data of the parts
C31-C34 C36-C39 = CMP-2006-02592-1: Part Number: GRM1885C1H100JA01D; Manufacturer: Murata
C35 C40 = CMP-2006-03879-3: Ceramic Capacitor 0.022Uf 50V, X7R, 10%, 0603, Full Reel; Manufacturer Part Number: C0603C223K5RACTU; Manufacturer: KEMET; Automotive Grade: Grade 1; Capacitance: 22,000 pF; Value: 22,000 pF; Tolerance: 0.1; Temperature Coefficient: 30ppm/°C; Material: Ceramic; Mouser Description: Capacitor; Ceramic; Cap; .022uF; Tol+10%; SMT; Vol-Rtg 50V; X7R; TR; Voltage Rating: 50 V; Category: Cap; Device Class L2: Capacitors; RoHS: TRUE; Package: C0603C-CF; Device Class L1: Passive Components; Temperature Range Low: -55°C; Octopart: https://octopart.com/c0603c223k5ractu-kemet-97352; Temperature: -55°C to +125°C; Temperature Range High: +125°C; Automotive: Yes; Lead Free: Yes; ComponentLink2URL: https://api.kemet.com/component-edge/download/datasheet/C0603C100J5GACAUTO.pdf; Temperature Characteristic: X7R; Height: 0.87mm; Device Class L3: Ceramic Capacitors; Digikey Description: Ceramic Capacitor 0.022Uf 50V, X7R, 10%, 0603, Full Reel; ComponentLink2Description: Datasheet
C41 = CMP-2006-02868-1: Part Number: GRM188R71E104KA01D; Manufacturer: Murata
ECAT_INPUT ECAT_OUTPUT = CMP-2000-07059-1: 1 Port RJ45 Magjack Connector with Yellow and Green LED, 10/100 Base-T, 12-Pin THD, RoHS, Tray; Manufacturer: Bel Fuse; Number of Ways: 8P4C; Gender: Female; Shield Type: STP; Connector Type: RJ45; Contact Plating: Gold; Mounting Type: ThroughHole; Datasheet Version: Rev. B0, 09/2008; Package Reference: SI-60062-F; Manufacturer URL: http://belfuse.com/; Package Description: 12-Pin Through Hole Device, Body 21.59 x 16.13 mm; Series: MagJack; Contact Material: CopperAlloy; Datasheet URL: http://belfuse.com/pdfs/SI-60062-F.pdf; Width: 17.98mm; Length: 15.21mm; Mounting Technology: ThroughHole; Depth: 21.59mm; Orientation: Straight
EtherCAT_EEPROM = CMP-0159-00532-1: 512Kbit, 1MHz, 2.5V, I2C Serial EEPROM, 8-Pin SOIC 208mil, Industrial Temperature; PackageDescription: 8-Lead Plastic Small Outline (SM) - Medium, 5.28 mm Body [SOIJ]; PackageReference: SOIJ-SM8; PackageVersion: revBB, Aug-2009; DatasheetVersion: revJ, Jul-2008
R16-R19 R24-R27 = CMP-1659-00036-1: General Purpose Chip Resistor, 49.9 Ohm, +/- 1%, -55 to 155 degC, 0603 (1608 Metric), RoHS, Tape and Reel; Max Supply Voltage: 3.63 V; Case\Package: LQFP; Interface: SPI; Min Supply Voltage: 2.97 V; PackageReference: 0603; Packaging: Tray; ComponentLink2Description: Datasheet; ComponentLink1Description: Manufacturer URL; ComponentLink2URL: https://datasheet.ciiva.com/11808/0900766b80f96399-11808223.pdf; RoHSCompliant: true; Max Operating Temperature: 85 degC; ComponentLink1URL: http://www.yageo.com/; PackageDescription: 2-Pin Surface Mount Device, Body 1.6 x 0.8 mm; DatasheetVersion: Rev. 4, 04/2009; Min Operating Temperature: -40 degC; Package Quantity: 250; Pins: 48
R20 R28 = CMP-2100-03667-1: Chip Resistor, 0 Ohm, +/- 5%, 0.1 W, -55 to 155 degC, 0603 (1608 Metric), RoHS, Tape and Reel; Manufacturer: Yageo; Temperature Coefficient: 200ppm/degreesC; Voltage Rating: 50V; Power Rating: 100mW; Resistance: 0mOhm; Width: 0.8mm; Max Operating Temperature: 155degC; Tolerance: 5%; Package Reference: 0603; Height: 0.45mm; Depth: 0.8mm; Package Description: 2-Pin Surface Mount Device, Body 1.6 x 0.8 mm; Termination: SMD/SMT; Package Quantity: 5000; Case/Package: 0603; Case Code (Imperial): 0603; Radiation Hardening: No; Number of Pins: 2; Length: 1.6mm; Lead Free: LeadFree; Voltage Rating (DC): 50V; Military Standard: Not; Datasheet URL: http://www.yageo.com/NewPortal/yageodocoutput?fileName=/pdf/R-Chip/PYu-RC_Group_51_RoHS_L_5.pdf; Manufacturer URL: http://www.yageo.com/; Packaging: TapeandReel; Case Code (Metric): 1608; Min Operating Temperature: -55degC; Composition: ThickFilm; RoHSCompliant: true; Contact Plating: Tin; Datasheet Version: Rev. 5, 10/2016; REACH SVHC: NoSVHC
R21 R22 R29 R30 = CMP-1659-00009-4: Chip Resistor, 1 KOhm, +/-1%, 0.1 W, -55 to 155 degC, 0603 (1608 Metric), RoHS, Tape and Reel; Manufacturer: Yageo; Voltage Rating: 50 V; ComponentLink2URL: http://www.yageo.com/documents/recent/PYu-RC_Group_51_RoHS_L_04.pdf; Max Operating Temperature: 155 degC; PackageDescription: 2-Pin Surface Mount Device, Body 1.6 x 0.8 mm; Packaging: Tape and Reel; ComponentLink3Description: Package Specification; REACH SVHC: No SVHC; Mount: Surface Mount; ComponentLink2Description: Datasheet; Length: 1.6 mm; PackageReference: 0603; Height: 0.45 mm; DatasheetVersion: Rev. 4, 02/2016; Min Operating Temperature: -55 degC; ComponentLink1Description: Manufacturer URL; Package Quantity: 200; RoHSCompliant: true; ComponentLink3URL: http://www.farnell.com/datasheets/443971.pdf; Pins: 2; Mounting Technology: Surface Mount; ComponentLink1URL: http://www.yageo.com/
R23 R31 = CMP-2005-00172-1: Part Number: CRCW12100000Z0EAHP; Manufacturer: Vishay Dale
R32-R34 = CMP-2100-03664-1: Chip Resistor, 10 KOhm, +/- 1%, 01 W, -55 to 155 degC, 0603 (1608 Metric), RoHS, Tape and Reel; Manufacturer: Yageo; Temperature Coefficient: 100ppm/degreesC; Resistance: 10KOhm; Voltage Rating: 75V; Power Rating: 100mW; Voltage Rating (DC): 50V; Composition: ThickFilm; RoHSCompliant: true; Height: 0.45mm; Lead Free: LeadFree; Case Code (Metric): 1608; Case/Package: 0603; Datasheet Version: Rev. 5, 10/2016; Package Reference: 0603; Depth: 0.8mm; Package Description: 2-Pin Surface Mount Device, Body 1.6 x 0.8 mm; Case Code (Imperial): 0603; Packaging: TapeandReel; Termination: SMD/SMT; Lead Pitch: 0.3mm; Width: 0.8mm; Number of Pins: 2; Length: 1.6mm; REACH SVHC: NoSVHC; Military Standard: Not; Max Operating Temperature: 155degC; Min Operating Temperature: -55degC; Manufacturer URL: http://www.yageo.com/; Datasheet URL: http://www.yageo.com/NewPortal/yageodocoutput?fileName=/pdf/R-Chip/PYu-RC_Group_51_RoHS_L_5.pdf; Weight: 7.1E-05oz; Tolerance: 1%
R35 R36 = CMP-2000-04430-1: Part Number: RT0603BRD072KL; Manufacturer: Yageo
R37 = CMP-2000-05024-1: Chip Resistor, 4.7 KOhm, +/- 5%, 100 mW, -55 to 155 degC, 0603 (1608 Metric), RoHS, Tape and Reel; Manufacturer: Yageo; Resistance: 4.7kOhms; Temperature Coefficient: 100PPM/C; Power Rating: 100mW; Voltage Rating: 50V; Operating Temperature Range: -55Cto+155C; Case Code - mm: 1608; Tolerance: 5%; Product: ThickFilmResistorsGeneralPurpose; Case Code - in: 0603; Datasheet URL: http://www.yageo.com/documents/recent/PYu-RC_Group_51_RoHS_L_04.pdf; Package Reference: 603; Datasheet Version: Rev. 4, 02/2016; Package Description: 2-Pin Surface Mount Device, Body 1.6 x 0.8 mm; Manufacturer URL: http://www.yageo.com/; Series: RC; Packaging: Reel; Termination Style: SMD/SMT

## Sheet LAN9252-1.SchDoc
size B
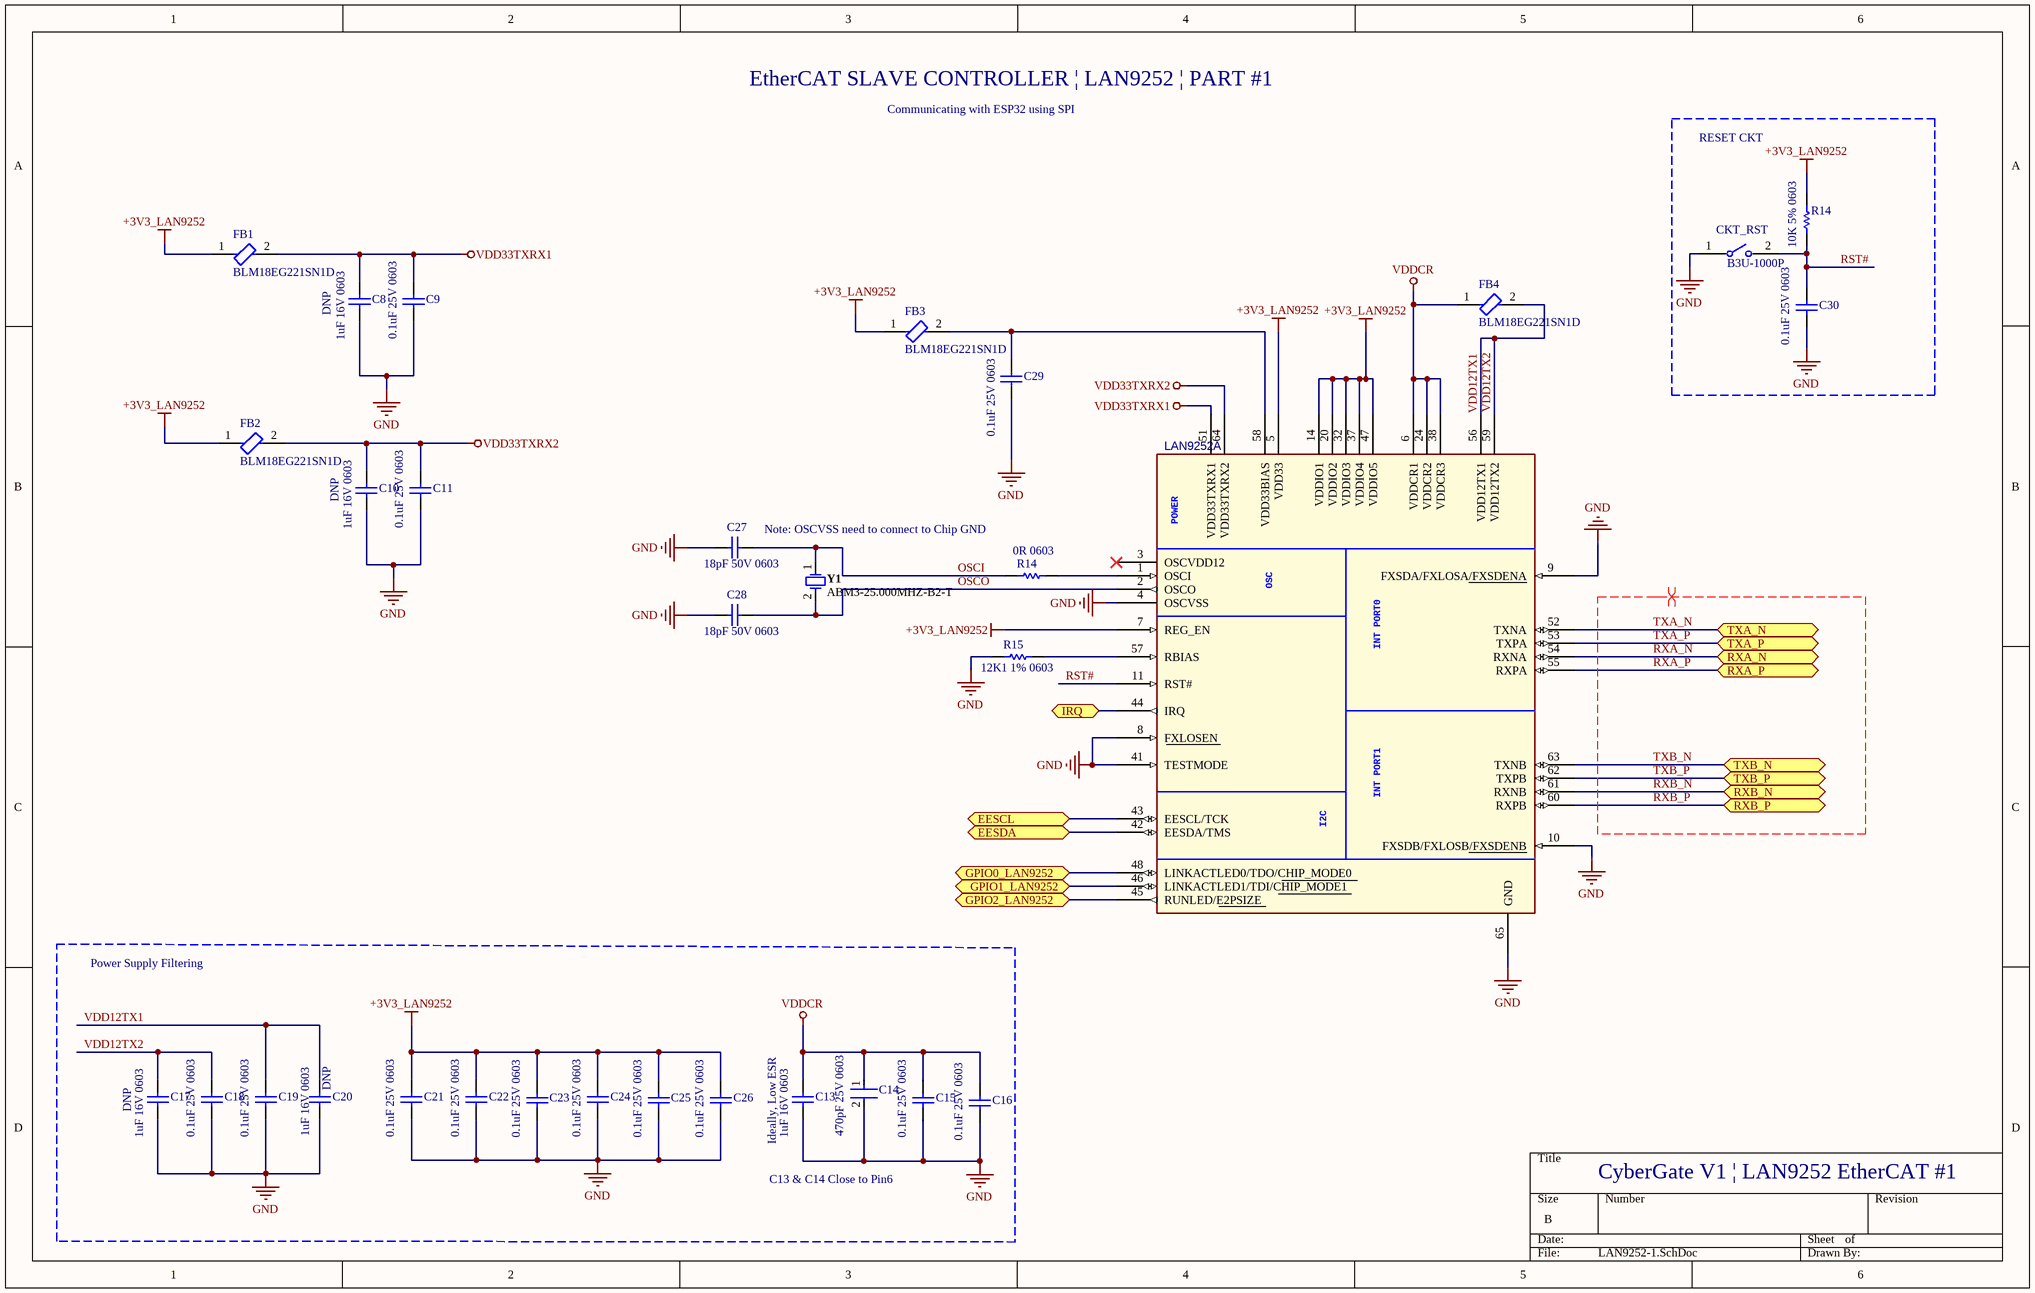
[diagram p3: LAN9252-1.SchDoc]

### Parts
(Parts that share a designator on the sheet are numbered #1, #2 ... from top to bottom, then left to right.)
C8  1uF 16V 0603  [CAPC1608X90X35LL15T15]
C9  0.1uF 25V 0603  [CAPC1608X90X35LL10T15]
C10  1uF 16V 0603  [CAPC1608X90X35LL15T15]
C11  0.1uF 25V 0603  [CAPC1608X90X35LL10T15]
C13  1uF 16V 0603  [CAPC1608X90X35LL15T15]
C14  470pF 25V 0603  [FP-C0603C-CF-MFG]
C15  0.1uF 25V 0603  [CAPC1608X90X35LL10T15]
C16  0.1uF 25V 0603  [CAPC1608X90X35LL10T15]
C17  1uF 16V 0603  [CAPC1608X90X35LL15T15]
C18  0.1uF 25V 0603  [CAPC1608X90X35LL10T15]
C19  0.1uF 25V 0603  [CAPC1608X90X35LL10T15]
C20  1uF 16V 0603  [CAPC1608X90X35LL15T15]
C21  0.1uF 25V 0603  [CAPC1608X90X35LL10T15]
C22  0.1uF 25V 0603  [CAPC1608X90X35LL10T15]
C23  0.1uF 25V 0603  [CAPC1608X90X35LL10T15]
C24  0.1uF 25V 0603  [CAPC1608X90X35LL10T15]
C25  0.1uF 25V 0603  [CAPC1608X90X35LL10T15]
C26  0.1uF 25V 0603  [CAPC1608X90X35LL10T15]
C27  18pF 50V 0603  [CAPC1608X90X40LL10T20]
C28  18pF 50V 0603  [CAPC1608X90X40LL10T20]
C29  0.1uF 25V 0603  [CAPC1608X90X35LL10T15]
C30  0.1uF 25V 0603  [CAPC1608X90X35LL10T15]
CKT_RST  B3U-1000P  [FP-B3U-1000P-MFG]
FB1  BLM18EG221SN1D  [FP-BLM18-0_15-t0_8-MFG]
FB2  BLM18EG221SN1D  [FP-BLM18-0_15-t0_8-MFG]
FB3  BLM18EG221SN1D  [FP-BLM18-0_15-t0_8-MFG]
FB4  BLM18EG221SN1D  [FP-BLM18-0_15-t0_8-MFG]
LAN9252  (no value)  [LAN9252_QFN]  (part A of 2)
R14#1  10K 5% 0603  [RESC1608X55X25ML10T15]
R14#2  0R 0603  [RESC1608X55X25ML10T15]
R15  12K1 1% 0603  [RESC0603X28X15ML05T05]
Y1  ABM3-25.000MHZ-B2-T  [ABRA-ABM3_V]

### Blocks framed on the sheet
RESET CKT: C30 CKT_RST R14#1

### Ports
EESCL (bidir), EESDA (bidir), GPIO0_LAN9252 (bidir), GPIO1_LAN9252 (bidir), GPIO2_LAN9252 (bidir), IRQ (bidir), RXA_N (bidir), RXA_P (bidir), RXB_N (bidir), RXB_P (bidir), TXA_N (bidir), TXA_P (bidir), TXB_N (bidir), TXB_P (bidir)

### Nets
+3V3_LAN9252: C21.2 C22.2 C23.2 C24.2 C25.2 C26.2 FB1.1 FB2.1 FB3.1 LAN9252.5(VDD33) LAN9252.7(REG_EN) LAN9252.14(VDDIO1) LAN9252.20(VDDIO2) LAN9252.32(VDDIO3) LAN9252.37(VDDIO4) LAN9252.47(VDDIO5) R14#1.2
GND: C8.1 C9.1 C10.1 C11.1 C13.1 C14.2 C15.1 C16.1 C17.1 C18.1 C19.1 C20.1 C21.1 C22.1 C23.1 C24.1 C25.1 C26.1 C27.1 C28.1 C29.1 C30.1 CKT_RST.1 LAN9252.4(OSCVSS) LAN9252.8(FXLOSEN) LAN9252.9(FXSDA/FXLOSA/FXSDENA) LAN9252.10(FXSDB/FXLOSB/FXSDENB) LAN9252.41(TESTMODE) LAN9252.65(GND) R15.1
VDD33TXRX1: C8.2 C9.2 FB1.2 LAN9252.51(VDD33TXRX1)
VDD33TXRX2: C10.2 C11.2 FB2.2 LAN9252.64(VDD33TXRX2)
VDDCR: C13.2 C14.1 C15.2 C16.2 FB4.1 LAN9252.6(VDDCR1) LAN9252.24(VDDCR2) LAN9252.38(VDDCR3)
IRQ: LAN9252.44(IRQ) ; port IRQ
OSCI: C27.2 R14#2.1 Y1.1
OSCO: C28.2 LAN9252.2(OSCO) Y1.2
RST#: C30.2 CKT_RST.2 LAN9252.11(RST#) R14#1.1
RXA_N: LAN9252.54(RXNA) ; port RXA_N
RXA_P: LAN9252.55(RXPA) ; port RXA_P
RXB_N: LAN9252.61(RXNB) ; port RXB_N
RXB_P: LAN9252.60(RXPB) ; port RXB_P
TXA_N: LAN9252.52(TXNA) ; port TXA_N
TXA_P: LAN9252.53(TXPA) ; port TXA_P
TXB_N: LAN9252.63(TXNB) ; port TXB_N
TXB_P: LAN9252.62(TXPB) ; port TXB_P
VDD12TX1: C17.2 C18.2 C19.2 C20.2 FB4.2 LAN9252.56(VDD12TX1) LAN9252.59(VDD12TX2)  [also labelled VDD12TX2]
NetC29_2: C29.2 FB3.2 LAN9252.58(VDD33BIAS)
NetEtherCAT_EEPROM_5: LAN9252.42(EESDA/TMS) ; port EESDA
NetEtherCAT_EEPROM_6: LAN9252.43(EESCL/TCK) ; port EESCL
NetLAN9252_1: LAN9252.1(OSCI) R14#2.2
NetLAN9252_45: LAN9252.45(RUNLED/E2PSIZE) ; port GPIO2_LAN9252
NetLAN9252_46: LAN9252.46(LINKACTLED1/TDI/CHIP_MODE1) ; port GPIO1_LAN9252
NetLAN9252_48: LAN9252.48(LINKACTLED0/TDO/CHIP_MODE0) ; port GPIO0_LAN9252
NetLAN9252_57: LAN9252.57(RBIAS) R15.2

Not connected (* = marked no-connect by the designer): LAN9252 3(OSCVDD12)*

### Layout directives
differential pair; differential pair class ETHERNET; rule Differential Pairs Routing [Pref Gap = 0.254mm    Min Gap  = 0.254mm    Max Gap  = 0.254mmPref Width = 0.381mm    Min Width  = 0.127mm    Max Width  = 0.381mm]: RXA_N, RXA_P, RXB_N, RXB_P, TXA_N, TXA_P, TXB_N, TXB_P

### Notes on the sheet
- EtherCAT SLAVE CONTROLLER | LAN9252 | PART #1
- Communicating with ESP32 using SPI
- (near C8) DNP
- (near C10) DNP
- Note: OSCVSS need to connect to Chip GND
- Power Supply Filtering
- (near C17) DNP
- (near C20) DNP
- (near C13) Ideally, Low ESR
- CyberGate V1 | LAN9252 EtherCAT #1
- C13 & C14 Close to Pin6
- (in symbol LAN9252_QFN64, part A) POWER; OSC; INT PORT0; INT PORT1; I2C

### Library data of the parts
C8 C10 C13 C17 C20 = CMP-2006-02298-2: as C5 on sheet USB-ESP32
C9 C11 C15 C16 C18 C19 C21-C26 C29 C30 = CMP-2006-02868-1: as C41 on sheet EtherCAT
C14 = CMP-1035-01671-3: CAP CER 470PF 25V 10% X7R 0603; Manufacturer: KEMET; Manufacturer Part Number: C0603C471K3RACTU; Tolerance: 0.1; Automotive Grade: Grade 1; Material: Ceramic; Temperature Coefficient: 30ppm/°C; Category: Cap; Device Class L2: Capacitors; ComponentLink2URL: https://api.kemet.com/component-edge/download/datasheet/C0603C100J5GACAUTO.pdf; Voltage Rating: 25 V; RoHS: TRUE; Value: 470 pF; Automotive: Yes; Capacitance: 470 pF; Temperature Characteristic: X7R; Height: 0.87mm; Lead Free: Yes; Temperature: -55°C to +125°C; Temperature Range High: +125°C; Package: C0603C-CF; Digikey Description: CAP CER 470PF 25V 10% X7R 0603; Mouser Description: Multilayer Ceramic Capacitors MLCC - SMD/SMT 25volts 470pF X7R 10%; Device Class L1: Passive Components; ComponentLink2Description: Datasheet; Device Class L3: Ceramic Capacitors; Temperature Range Low: -55°C; Octopart: https://octopart.com/c0603c471k3ractu-kemet-9143746
C27 C28 = CMP-1659-00030-1: Chip Capacitor, 18 pF, +/- 5%, 50 V, -55 to 125 degC, 0603 (1608 Metric), RoHS, Tape and Reel; Case\Package: 0603; Power Rating: 100 mW; Resistance: 68.1 Ohm; Tolerance: 1%; Case Code (Metric): 1608; Max Operating Temperature: 155 degC; RoHSCompliant: true; Case Code (Imperial): 0603; Voltage Rating: 50 V; ComponentLink2Description: Datasheet; Package Quantity: 200; PackageReference: 0603; ComponentLink2URL: http://www.yageo.com/NewPortal/yageodocoutput?fileName=/pdf/MLCC/UPY-GP_NP0_16V-to-50V_14.pdf; Length: 1.6 mm; DatasheetVersion: Rev. 14, 07/2016; Min Operating Temperature: -55 degC; ComponentLink1URL: http://www.yageo.com/; Width: 0.8 mm; ComponentLink1Description: Manufacturer URL; Height: 0.45 mm; Radiation Hardening: No; PackageDescription: 2-Pin Surface Mount Device, Body 1.6 x 0.8 mm; Packaging: Tape and Reel
CKT_RST = CMP-2100-03586-2: as ESP32_BOOT on sheet ESP32; Height: 1.2mm; Width: 3mm; Weight: 0.000776oz; Contact Material: Silver; Max Voltage Rating (DC): 12V; Insulation Resistance: 100MR; Lead Free: Lead Free; Current Rating: 50mA; Termination: SMD/SMT; Length: 4mm; Voltage Rating (DC): 12V; Contact Current Rating: 50mA; Orientation: Straight; Depth: 2.5mm; Max Operating Temperature: 70°C; Packaging: Tape and Reel; Min Operating Temperature: -25°C; Package Quantity: 1; Mount: Surface Mount; Electrical Life: 200000Cycles
FB1-FB4 = CMP-0686-00360-3: Chip Ferrite Bead, 0603, 220Ω @ 100MHz, 0.05Ω, 25%, 2A; Impedance: 220R; Number of Lines: 1; Material: Steel; Resistance: 50mR; Core Material: Ferrite; Test Frequency: 100MHz; Contact Plating: Tin; Case Code (Imperial): 0603; DC Current: 2A; Lead Free: Lead Free; Frequency: 100MHz; Max Current Rating: 2A; Depth: 0.8mm; Width: 0.8mm; Number of Pins: 2; Min Operating Temperature: -55°C; Package Quantity: 1; Tolerance: 25%; Max Operating Temperature: 125°C; Height: 0.8mm; Military Standard: Not; Termination: SMD/SMT; REACH SVHC: No SVHC; Max DC Current: 2A; Radiation Hardening: No; Case Code (Metric): 1608; Current Rating: 2A; Number of Circuits: 1; Length: 1.6mm; Case/Package: 0603; Packaging: Tape and Reel; DC Resistance (DCR): 50mR
LAN9252 = LAN9252_QFN64: IC, 2/3-Port EtherCAT® Slave Controller, QFN64; Manufacturer Part Number 1: LAN9252x/ML; Manufacturer 1: Microchip; Populated: Yes; Owner: Manikandan; Supplier Part Number 1: LAN9252I/ML-ND; Supplier 1: Digikey; Description_: IC, 2/3-Port EtherCAT® Slave Controller, QFN64; RoHS: Yes; Package: QFN64-9X9x1; Document Link: http://ww1.microchip.com/downloads/en/DeviceDoc/00001909A.pdf; Status: New
R14#1 = CMP-2100-03664-1: as R32 on sheet EtherCAT; Composition: ThickFilm; RoHSCompliant: true; Height: 0.45mm; Lead Free: LeadFree; Case Code (Metric): 1608; Case/Package: 0603; Datasheet Version: Rev. 5, 10/2016; Package Reference: 0603; Depth: 0.8mm; Package Description: 2-Pin Surface Mount Device, Body 1.6 x 0.8 mm; Case Code (Imperial): 0603; Packaging: TapeandReel; Termination: SMD/SMT; Lead Pitch: 0.3mm; Width: 0.8mm; Number of Pins: 2; Length: 1.6mm; REACH SVHC: NoSVHC; Military Standard: Not; Max Operating Temperature: 155degC; Min Operating Temperature: -55degC; Manufacturer URL: http://www.yageo.com/; Datasheet URL: http://www.yageo.com/NewPortal/yageodocoutput?fileName=/pdf/R-Chip/PYu-RC_Group_51_RoHS_L_5.pdf; Weight: 7.1E-05oz; Tolerance: 1%
R14#2 = CMP-2100-03667-1: as R20 on sheet EtherCAT; Width: 0.8mm; Max Operating Temperature: 155degC; Tolerance: 5%; Package Reference: 0603; Height: 0.45mm; Depth: 0.8mm; Package Description: 2-Pin Surface Mount Device, Body 1.6 x 0.8 mm; Termination: SMD/SMT; Package Quantity: 5000; Case/Package: 0603; Case Code (Imperial): 0603; Radiation Hardening: No; Number of Pins: 2; Length: 1.6mm; Lead Free: LeadFree; Voltage Rating (DC): 50V; Military Standard: Not; Datasheet URL: http://www.yageo.com/NewPortal/yageodocoutput?fileName=/pdf/R-Chip/PYu-RC_Group_51_RoHS_L_5.pdf; Manufacturer URL: http://www.yageo.com/; Packaging: TapeandReel; Case Code (Metric): 1608; Min Operating Temperature: -55degC; Composition: ThickFilm; RoHSCompliant: true; Contact Plating: Tin; Datasheet Version: Rev. 5, 10/2016; REACH SVHC: NoSVHC
R15 = CMP-2004-00071-1: Part Number: CRCW020112K1FNED; Manufacturer: Vishay Dale
Y1 = CMP-2000-05729-1: Miniature Ceramic Crystal, 25 MHz, +/- 20 ppm, -20 to 70 degC, 2-Pin SMD, RoHS, Tape and Reel; Manufacturer: ABRACON; Case Height: 1.3mm; Tolerance: 20PPM; Load Capacitance: 18pF; Frequency: 25MHz; ESR: 30Ohms; Frequency Stability: 50PPM; Case Width: 3.2mm; Case Length: 5mm; Packaging: Reel; Package Description: 2-Pin Surface Mount Device, Body 5 x 3.2 mm; Manufacturer URL: http://www.abracon.com/; Mounting Technology: SurfaceMount; RoHS: Details; Operating Temperature Range: -20Cto+70C; Datasheet URL: http://www.abracon.com/Resonators/abm3.pdf; Type: MiniatureCeramicCrystal; Series: ABM3; Product Category: Crystals; Factory Pack Quantity: 1000; Mounting Style: SMD/SMT; Brand: ABRACON; Datasheet Version: 09/2013; Dimensions: 3.2mmWx5mmLx1.3mmH; Termination Style: SMD/SMT; Package Reference: ABM3; Package / Case: 5mmx3.2mm

## Sheet LAN9252-2.SchDoc
size B
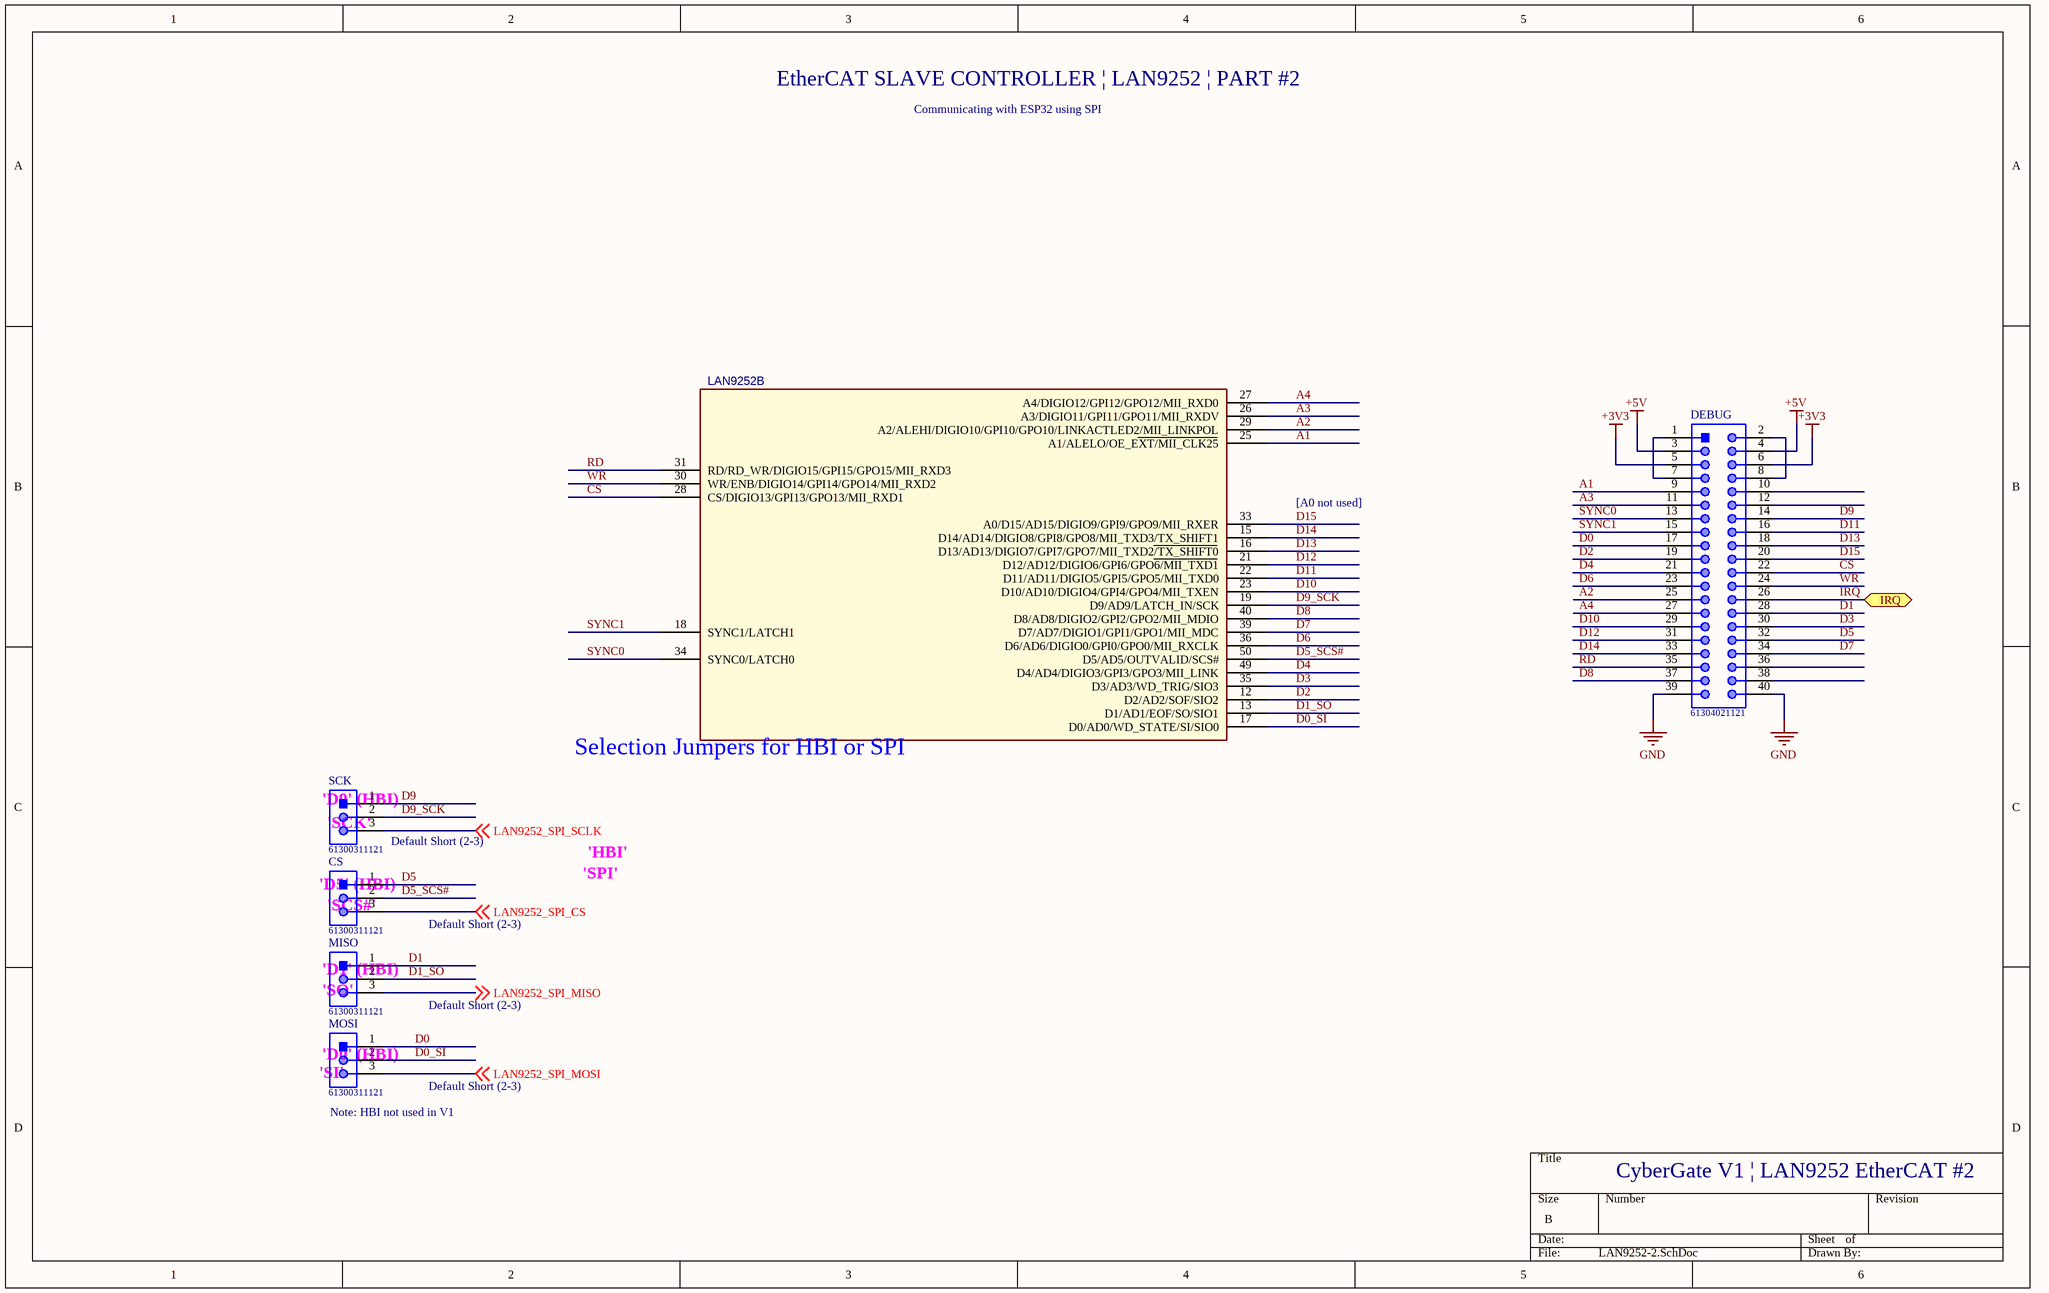
[diagram p4: LAN9252-2.SchDoc]

### Parts
CS  61300311121  [61300311121]
DEBUG  61304021121  [61304021121]
LAN9252  (no value)  [LAN9252_QFN]  (part B of 2)
MISO  61300311121  [61300311121]
MOSI  61300311121  [61300311121]
SCK  61300311121  [61300311121]

### Ports
IRQ (bidir)

### Nets
+3V3: DEBUG.5 DEBUG.6
+5V: DEBUG.3 DEBUG.4
GND: DEBUG.39 DEBUG.40
A1: DEBUG.9 LAN9252.25(A1/ALELO/OE_EXT/MII_CLK25)
A2: DEBUG.25 LAN9252.29(A2/ALEHI/DIGIO10/GPI10/GPO10/LINKACTLED2/MII_LINKPOL)
A3: DEBUG.11 LAN9252.26(A3/DIGIO11/GPI11/GPO11/MII_RXDV)
A4: DEBUG.27 LAN9252.27(A4/DIGIO12/GPI12/GPO12/MII_RXD0)
CS: DEBUG.22 LAN9252.28(CS/DIGIO13/GPI13/GPO13/MII_RXD1)
D0: DEBUG.17 MOSI.1
D0_SI: LAN9252.17(D0/AD0/WD_STATE/SI/SIO0) MOSI.2
D1: DEBUG.28 MISO.1
D1_SO: LAN9252.13(D1/AD1/EOF/SO/SIO1) MISO.2
D2: DEBUG.19 LAN9252.12(D2/AD2/SOF/SIO2)
D3: DEBUG.30 LAN9252.35(D3/AD3/WD_TRIG/SIO3)
D4: DEBUG.21 LAN9252.49(D4/AD4/DIGIO3/GPI3/GPO3/MII_LINK)
D5: CS.1 DEBUG.32
D5_SCS#: CS.2 LAN9252.50(D5/AD5/OUTVALID/SCS#)
D6: DEBUG.23 LAN9252.36(D6/AD6/DIGIO0/GPI0/GPO0/MII_RXCLK)
D7: DEBUG.34 LAN9252.39(D7/AD7/DIGIO1/GPI1/GPO1/MII_MDC)
D8: DEBUG.37 LAN9252.40(D8/AD8/DIGIO2/GPI2/GPO2/MII_MDIO)
D9: DEBUG.14 SCK.1
D9_SCK: LAN9252.19(D9/AD9/LATCH_IN/SCK) SCK.2
D10: DEBUG.29 LAN9252.23(D10/AD10/DIGIO4/GPI4/GPO4/MII_TXEN)
D11: DEBUG.16 LAN9252.22(D11/AD11/DIGIO5/GPI5/GPO5/MII_TXD0)
D12: DEBUG.31 LAN9252.21(D12/AD12/DIGIO6/GPI6/GPO6/MII_TXD1)
D13: DEBUG.18 LAN9252.16(D13/AD13/DIGIO7/GPI7/GPO7/MII_TXD2/TX_SHIFT0)
D14: DEBUG.33 LAN9252.15(D14/AD14/DIGIO8/GPI8/GPO8/MII_TXD3/TX_SHIFT1)
D15: DEBUG.20 LAN9252.33(A0/D15/AD15/DIGIO9/GPI9/GPO9/MII_RXER)
IRQ: DEBUG.26 ; port IRQ
LAN9252_SPI_CS: CS.3 ; off-sheet LAN9252_SPI_CS
LAN9252_SPI_MISO: MISO.3 ; off-sheet LAN9252_SPI_MISO
LAN9252_SPI_MOSI: MOSI.3 ; off-sheet LAN9252_SPI_MOSI
LAN9252_SPI_SCLK: SCK.3 ; off-sheet LAN9252_SPI_SCLK
RD: DEBUG.35 LAN9252.31(RD/RD_WR/DIGIO15/GPI15/GPO15/MII_RXD3)
SYNC0: DEBUG.13 LAN9252.34(SYNC0/LATCH0)
SYNC1: DEBUG.15 LAN9252.18(SYNC1/LATCH1)
WR: DEBUG.24 LAN9252.30(WR/ENB/DIGIO14/GPI14/GPO14/MII_RXD2)
NetDEBUG_1: DEBUG.1 DEBUG.7
NetDEBUG_2: DEBUG.2 DEBUG.8

Not connected (* = marked no-connect by the designer): DEBUG 10 12 36 38

### Notes on the sheet
- EtherCAT SLAVE CONTROLLER | LAN9252 | PART #2
- Communicating with ESP32 using SPI
- [A0 not used]
- (near SCK) Selection Jumpers for HBI or SPI
- (near SCK) 'D9' (HBI)
- (near SCK) 'SCK'
- 'D5' (HBI)
- (near CS) 'SCS#'
- Default Short (2-3)
- 'SPI'
- 'HBI'
- (near MISO) 'D1' (HBI)
- (near MISO) 'SO'
- (near MOSI) 'SI'
- (near MOSI) 'D0' (HBI)
- (near MOSI) Note: HBI not used in V1
- CyberGate V1 | LAN9252 EtherCAT #2

### Library data of the parts
CS MISO MOSI SCK = CMP-1502-01062-1: THT Vertical Pin Header WR-PHD, Pitch 2.54 mm, Single Row, 3 pins; Manufacturer: Wurth Elektronik; Withstanding Voltage: 500VAC; Working Voltage: 250VAC; Rated Current: 3A; Pitch: 2.54mm; Pin Number: 3; Gender: Male; Contact Resistance: 20mOhm; Package Reference: 61300311121; Manufacturer URL: http://www.we-online.de; Datasheet URL: https://katalog.we-online.de/em/datasheet/6130xx11121.pdf; Operating Temperature: -40to105degC; Part Number: 61300311121; Orientation: Vertical; Packaging: Bag; Row Number: Single; Mounting Technology: THT; Publisher: WurthElektronik
DEBUG = CMP-1502-01135-1: THT Vertical Pin Header WR-PHD, Pitch 2.54 mm, Dual Row, 40 pins; Manufacturer: Wurth Elektronik; Contact Resistance: 20mOhm; Pitch: 2.54mm; Pin Number: 40; Withstanding Voltage: 500VAC; Gender: Male; Rated Current: 3A; Working Voltage: 250VAC; Operating Temperature: -40to105degC; Manufacturer URL: http://www.we-online.de; Orientation: Vertical; Datasheet URL: https://katalog.we-online.de/em/datasheet/6130xx21121.pdf; Package Reference: 61304021121; Row Number: Dual; Part Number: 61304021121; Packaging: Bag; Mounting Technology: THT; Publisher: WurthElektronik
LAN9252 = LAN9252_QFN64: as LAN9252 on sheet LAN9252-1; Supplier Part Number 1: LAN9252I/ML-ND; Supplier 1: Digikey; Description_: IC, 2/3-Port EtherCAT® Slave Controller, QFN64; RoHS: Yes; Package: QFN64-9X9x1; Document Link: http://ww1.microchip.com/downloads/en/DeviceDoc/00001909A.pdf; Status: New